# EasyEDA Pro project ProPrj_2024校电赛滤波器_2024-07-15.epro

# Schematic 滤波器+功放
Create Date: 2024-05-03; Page Name: P1; Project Name: 滤波器1.1; Schematic Name: Schematic1; Update Date: 2024-05-12; Company: 嘉立创EDA; Page Size: A4; Version: V1.0
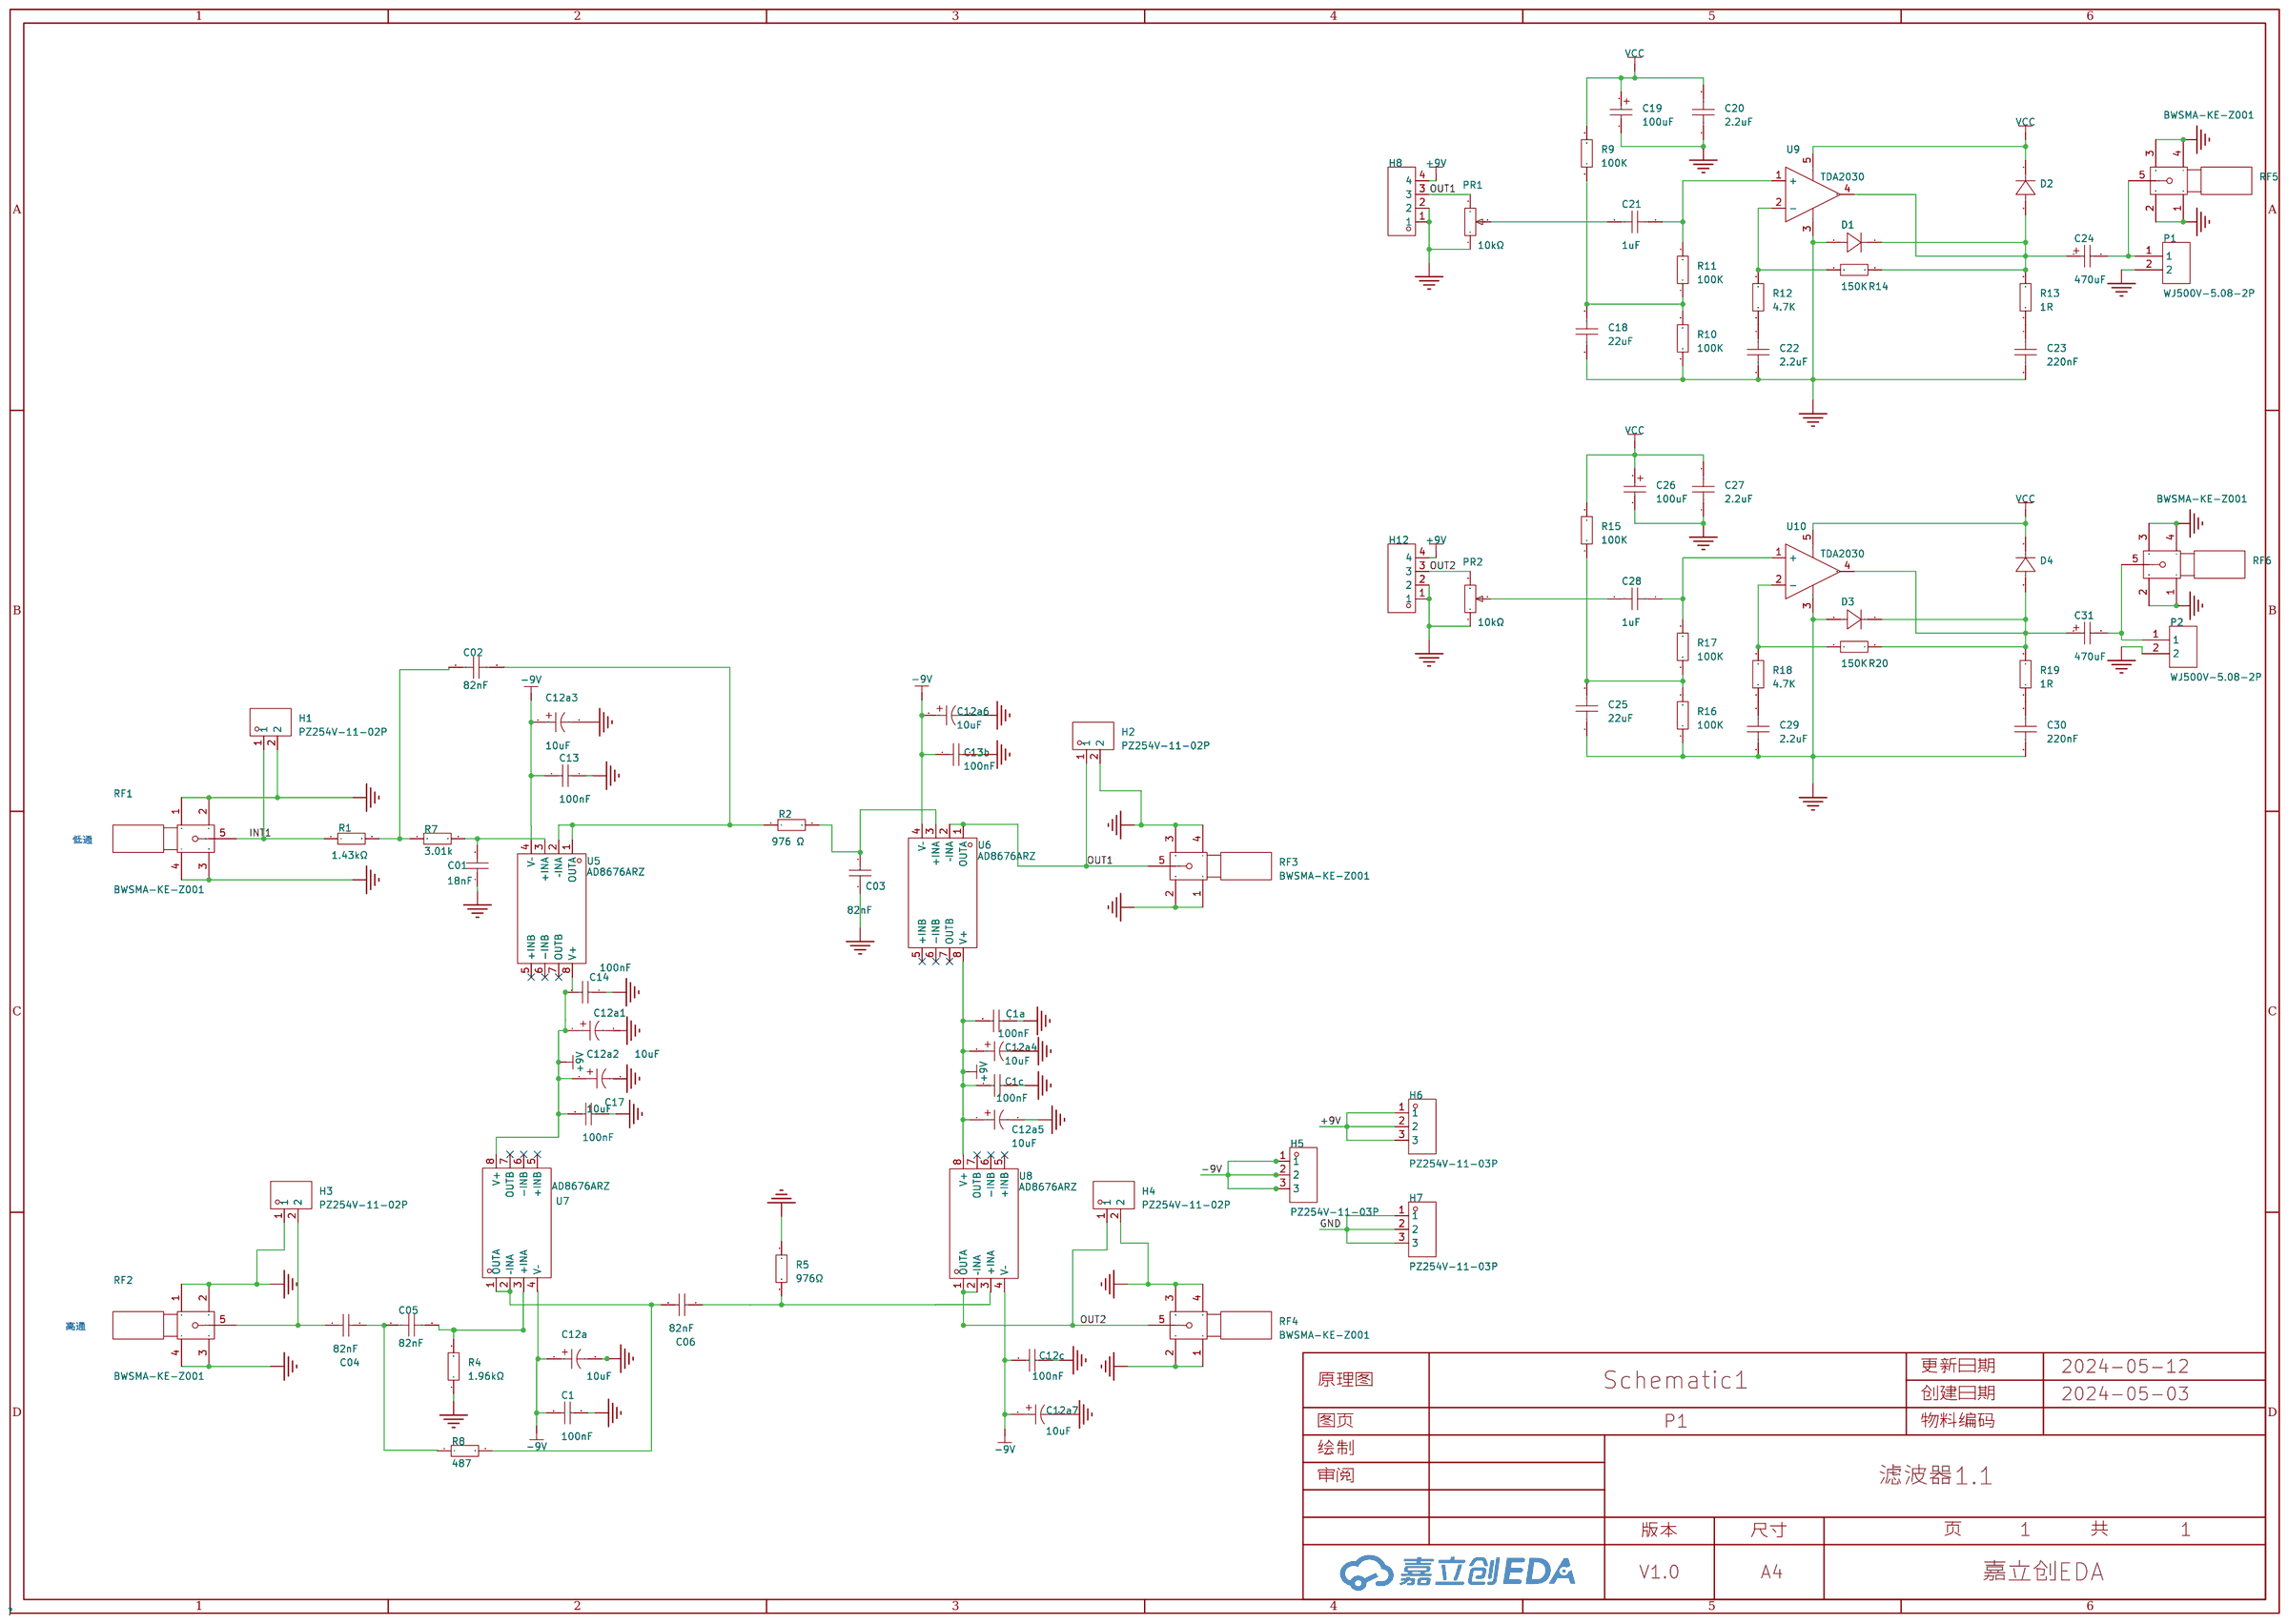
[diagram p0: schematic sheet]

## Parts
C01  18nF  [C0805]
C1  100nF  [C0805-100nF]
C1a  100nF  [C0805-100nF]
C1c  100nF  [C0805-100nF]
C02  82nF  [C0805]
C03  82nF  [C0805]
C04  82nF  [C0805]
C05  82nF  [C0805]
C06  82nF  [C0805]
C12a  10uF  [C-SMD5.4]
C12a1  10uF  [C-SMD5.4]
C12a2  10uF  [C-SMD5.4]
C12a3  10uF  [C-SMD5.4]
C12a4  10uF  [C-SMD5.4]
C12a5  10uF  [C-SMD5.4]
C12a6  10uF  [C-SMD5.4]
C12a7  10uF  [C-SMD5.4]
C12c  100nF  [C0805-100nF]
C13  100nF  [C0805-100nF]
C13b  100nF  [C0805-100nF]
C14  100nF  [C0805-100nF]
C17  100nF  [C0805-100nF]
C18  22uF  [C0805]
C19  100uF  [C_Ele_SMD_5x5.4mm]
C20  2.2uF  [C0805]
C21  1uF  [C0805]
C22  2.2uF  [C0805]
C23  220nF  [C0805]
C24  470uF  [C_Ele_SMD_5x5.4mm]
C25  22uF  [C0805]
C26  100uF  [C_Ele_SMD_5x5.4mm]
C27  2.2uF  [C0805]
C28  1uF  [C0805]
C29  2.2uF  [C0805]
C30  220nF  [C0805]
C31  470uF  [C_Ele_SMD_5x5.4mm]
D1  -  [DO_1N4007]
D2  -  [DO_1N4007]
D3  -  [DO_1N4007]
D4  -  [DO_1N4007]
H1  PZ254V-11-02P  [HDR-TH_2P-P2.54-V-M]
H2  PZ254V-11-02P  [HDR-TH_2P-P2.54-V-M]
H3  PZ254V-11-02P  [HDR-TH_2P-P2.54-V-M]
H4  PZ254V-11-02P  [HDR-TH_2P-P2.54-V-M]
H5  PZ254V-11-03P  [HDR-TH_3P-P2.54-V-M]
H6  PZ254V-11-03P  [HDR-TH_3P-P2.54-V-M]
H7  PZ254V-11-03P  [HDR-TH_3P-P2.54-V-M]
H8  -  [HDR-TH_4P-P2.54-V-M]
H12  -  [HDR-TH_4P-P2.54-V-M]
P1  WJ500V-5.08-2P  [CONN-TH_2P-P5.00_WJ500V-5.08-2P]
P2  WJ500V-5.08-2P  [CONN-TH_2P-P5.00_WJ500V-5.08-2P]
PR1  10kΩ  [R_3296]
PR2  10kΩ  [R_3296]
R1  1.43kΩ  [C0805]
R2  976 Ω  [C0805]
R4  1.96kΩ  [C0805]
R5  976Ω  [C0805]
R7  3.01k  [C0805]
R8  487  [C0805]
R9  100K  [R0805]
R10  100K  [R0805]
R11  100K  [R0805]
R12  4.7K  [R0805]
R13  1R  [R0805]
R14  150K  [R0805]
R15  100K  [R0805]
R16  100K  [R0805]
R17  100K  [R0805]
R18  4.7K  [R0805]
R19  1R  [R0805]
R20  150K  [R0805]
RF1  BWSMA-KE-Z001  [SMA-TH_BWSMA-KE-Z001]
RF2  BWSMA-KE-Z001  [SMA-TH_BWSMA-KE-Z001]
RF3  BWSMA-KE-Z001  [SMA-TH_BWSMA-KE-Z001]
RF4  BWSMA-KE-Z001  [SMA-TH_BWSMA-KE-Z001]
RF5  BWSMA-KE-Z001  [SMA-TH_BWSMA-KE-Z001]
RF6  BWSMA-KE-Z001  [SMA-TH_BWSMA-KE-Z001]
U5  AD8676ARZ  [SOIC-8_L4.9-W3.9-P1.27-LS6.0-BL]
U6  AD8676ARZ  [SOIC-8_L4.9-W3.9-P1.27-LS6.0-BL]
U7  AD8676ARZ  [SOIC-8_L4.9-W3.9-P1.27-LS6.0-BL]
U8  AD8676ARZ  [SOIC-8_L4.9-W3.9-P1.27-LS6.0-BL]
U9  TDA2030  [TO-220-5_L10.2-W4.8-P1.70-TL]
U10  TDA2030  [TO-220-5_L10.2-W4.8-P1.70-TL]

## Library data of the parts
C01 C1 C1a C1c C03 C04 C06 C12c C13 C13b C14 C17 = 0805B104J500NT: 容值:100nF;精度:±5%;额定电压:50V;材质(温度系数):X7R;; LCSC Part Name: 100nF ±5% 50V; Supplier Part: C29926; Manufacturer: FH(风华); Supplier Footprint: 0805; JLCPCB Part Class: 扩展库; Datasheet: https://atta.szlcsc.com/upload/public/pdf/source/20200305/C486355_26A10D38EF8C2A5C37091D0039909270.pdf; Supplier: LCSC; Tolerance: ±5%; Voltage Rated: 50V; Temperature Coefficient: X7R
C02 C05 = CAP_0603: Supplier Footprint: 0603
C12a C12a1-C12a7 = 293D106X9025C2WE3: 容值:220uF;精度:±20%;额定电压:16V;纹波电流:110mA@120Hz;等效串联电阻:-;; Supplier Part: C3009557; Manufacturer: VISHAY(威世); Supplier Footprint: 6032; JLCPCB Part Class: Extended Part; Datasheet: https://atta.szlcsc.com/upload/public/pdf/source/20230801/388CBBD5D388C822BCFA987A3F755494.pdf; Supplier: LCSC; Tolerance: ±20%; Rated Voltage: 16V; Ripple Current: 110mA@120Hz; φD: 6.3mm; L: 7.7mm; Lifetime @ Temp: 2000hrs@105℃; Operating Temperature: -55℃~+105℃
C18 C20-C23 C25 C27-C30 = CAP_0805: Supplier Footprint: 0805
C19 C24 C26 C31 = C_Ele_SMD_5x5.4mm: Supplier Footprint: SMD,5x5.4mm
D1-D4 = D_1N4007A: Supplier Footprint: DO-41
H1-H4 = PZ254V-11-02P: 插针结构:1x2P;间距:2.54mm;行距:-;圆针/方针:方针;安装类型:直插;排数:单排;总PIN位数:2P;额定电流:-;额定电压:-;配合针长度:6mm;塑高:2.5mm;端接针长度:3mm;触头材质:黄铜;触头镀层:-;工作温度范围:-40℃~+105℃;颜色:黑色;; LCSC Part Name: 间距:2.54mm 1x2P 直插 方针; Supplier Part: C492401; Manufacturer: XFCN(兴飞); Supplier Footprint: 插件,P=2.54mm; JLCPCB Part Class: 扩展库; Datasheet: https://atta.szlcsc.com/upload/public/pdf/source/20200309/C492401_A812433581A9B211A7FFA413ADDFF0E5.pdf; Supplier: LCSC; Pin Structure: 1x2P; Pitch: 2.54mm; Circluar Pins/Square Pins: 方针; Mounting Type: 直插; Number of Rows: 单排; Number of Pins: 2P; Length of Mating Pin: 6mm; Insulation Height: 2.5mm; Length of End Connection Pin: 3mm; Contact Material: 黄铜; Operating Temperature Range: -40℃~+105℃; Color: 黑色
H5-H7 = PZ254V-11-03P: 插针结构:1x3P;间距:2.54mm;行距:-;圆针/方针:方针;安装类型:直插;排数:单排;总PIN位数:3P;额定电流:3A;额定电压:250V;配合针长度:6mm;塑高:2.5mm;端接针长度:3mm;工作温度范围:-40℃~+105℃;颜色:黑色;; LCSC Part Name: 间距:2.54mm 1x3P 直插 方针; Supplier Part: C2937625; Manufacturer: XFCN(兴飞); Supplier Footprint: 插件,P=2.54mm; JLCPCB Part Class: 扩展库; Datasheet: https://atta.szlcsc.com/upload/public/pdf/source/20200309/C492402_8335C3D49C4E4C618838D59BB1D024C1.pdf; Supplier: LCSC; Pin Structure: 1x3P; Pitch: 2.54mm; Circluar Pins/Square Pins: 方针; Mounting Type: 直插; Number of Rows: 单排; Number of Pins: 3P; Current Rating (Max): 3A; Voltage Rating (Max): 250V; Length of Mating Pin: 6mm; Insulation Height: 2.5mm; Length of End Connection Pin: 3mm; Operating Temperature Range: -40℃~+105℃; Color: 黑色
H8 H12 = HDR-M_2.54_1x4P: Supplier Part: C492403; Supplier Footprint: 插件
P1 P2 = WJ500V-5.08-2P: 结构:1x2P;间距:5.08mm;颜色:绿色;安装方式:直插;额定电流:18A;额定电压:250V;排数:1;线规 - AWG:14~30;线规 - 平方毫米:2.5;每排PIN数:2;触头材质:-;触头镀层:-;工作温度范围:-40℃~+105℃;焊接温度(最大值):-;; LCSC Part Name: 1x2P 5.08mm 直插 排数:1 每排P数:2; Supplier Part: C8465; Manufacturer: KANGNEX(康奈克斯电气); Supplier Footprint: 插件,P=5.08mm; JLCPCB Part Class: Extended Part; Datasheet: https://atta.szlcsc.com/upload/public/pdf/source/20191225/C8465_02D34CE5B5B4A53DF5891601D97FA9F4.pdf; Supplier: LCSC; Structure: 1x2P; Pitch: 5.08mm; Color: 绿色; Mounting Style: 直插; Current Rating (Max): 18A; Voltage Rating (Max): 250V; Number of Pins: 2P; Number of Rows: 1; Wire Gauge - AWG: 14~30; Wire Gauge - mm2: 2.5; Number of PINs Per Row: 2; Operating Temperature Range: -40℃~+105℃; Screw Specification: M2.5
PR1 PR2 = R_3296: Supplier Footprint: 直插
R1 R2 R4 R5 = 0805W8F1002T5E_C17414: 电阻类型:厚膜电阻;阻值:10kΩ;精度:±1%;功率:125mW;最大工作电压:150V;温度系数:±100ppm/℃;; LCSC Part Name: 10kΩ ±1% 125mW 厚膜电阻; Supplier Part: C17414; Manufacturer: UNI-ROYAL(厚声); Manufacturer Part: 0805W8F1002T5E; Supplier Footprint: 0805; JLCPCB Part Class: 基础库; Datasheet: https://atta.szlcsc.com/upload/public/pdf/source/20200306/C422600_1E6D84923E4A46A82E41ADD87F860B5C.pdf; Supplier: LCSC; Type: 厚膜电阻; Tolerance: ±1%; Power(Watts): 125mW; Overload Voltage (Max): 150V; Temperature Coefficient: ±100ppm/℃; Operating Temperature Range: -55℃~+155℃
R7 R8 = Res_0603: Supplier Footprint: 0603
R9-R20 = Res_0805: Supplier Footprint: 0805
RF1-RF6 = BWSMA-KE-Z001_C496549: 连接器类型:板端;接口类型:内孔;端口数量:1;接口直径:-;接口长度/高度:-;频率-最大值:-;射频系列:SMA;阻抗:50Ω;样式:正脚;触头材质:-;触头镀层:-;工作温度范围:-65℃~+165℃;焊接温度(最大值):-;; LCSC Part Name: 内孔 SMA 正脚; Supplier Part: C496549; Manufacturer: BAT WIRELESS(蝙蝠无线); Supplier Footprint: 插件; JLCPCB Part Class: 扩展库; Datasheet: https://atta.szlcsc.com/upload/public/pdf/source/20221228/40BF41E56A06003A0210E1785CA66EA6.pdf; Supplier: LCSC; Connector Type: 板端; Interface Type: 内孔; Number of Ports: 1; RF Series: SMA; Impedance: 50Ω; Style: 正脚; Operating Temperature Range: -65℃~+165℃
U5-U8 = AD8676ARZ: 放大器数:双路;增益带宽积(GBP):10MHz;输入偏置电流(Ib):2nA;压摆率(SR):2.5V/us;带宽(-3db):-;轨到轨:-;; Supplier Part: C99967; Manufacturer: ADI(亚德诺); Supplier Footprint: SOIC-8; JLCPCB Part Class: 扩展库; Datasheet: https://atta.szlcsc.com/upload/public/pdf/source/20170330/1490855744326.pdf; Supplier: LCSC; Number of Circuits: 双路; Gain Bandwidth Product(GBP): 10MHz; Current - Input Bias(Ib): 2nA; Slew Rate(SR): 2.5V/us; Output Current: 20mA; Supply Current: 2.7mA; Operating Temperature: -40℃~+125℃
U9 U10 = TDA2030_C5296731: TDA2030AL-TB5-T TDA2030 TDA2030L-TB5-T TFA2050; LCSC Part Name: TDA2030A; Supplier Part: C5296731; Manufacturer: JSMSEMI(杰盛微); Supplier Footprint: FZIP5; JLCPCB Part Class: 扩展库; Datasheet: https://atta.szlcsc.com/upload/public/pdf/source/20240105/2117F205BDD887DF1502453718A0C1E3.pdf; Supplier: LCSC

## Nets
+9V: C1a.2 C1c.2 C12a1.1 C12a2.1 C12a4.1 C12a5.1 C14.2 C17.2 H6.1 H6.2 H6.3 H8.4 H12.4 U5.8(V+) U7.8(V+)
-9V: C1.2 C12a.1 C12a3.1 C12a6.1 C12a7.1 C12c.2 C13.2 C13b.2 H5.1 H5.2 H5.3 U5.4(V–) U7.4(V–)
GND: C01.1 C1.1 C1a.1 C1c.1 C03.1 C12a.2 C12a1.2 C12a2.2 C12a3.2 C12a4.2 C12a5.2 C12a6.2 C12a7.2 C12c.1 C13.1 C13b.1 C14.1 C17.1 C18.1 C19.2 C20.1 C22.2 C23.2 C25.1 C26.2 C27.1 C29.2 C30.2 D1.2(A) D3.2(A) H1.2 H2.2 H3.1 H4.2 H7.1 H7.2 H7.3 H8.1 H8.2 H12.1 H12.2 P1.2 P2.2 PR1.1 PR2.1 R4.1 R5.1 R10.1 R16.1 RF1.1 RF1.2 RF1.3 RF1.4 RF2.1 RF2.2 RF2.3 RF2.4 RF3.1 RF3.2 RF3.3 RF3.4 RF4.1 RF4.2 RF4.3 RF4.4 RF5.1 RF5.2 RF5.3 RF5.4 RF6.1 RF6.2 RF6.3 RF6.4 U9.3(GND) U10.3(GND)
VCC: C19.1 C20.2 C26.1 C27.2 D2.1(K) D4.1(K) R9.2 R15.2 U9.5(VCC+) U10.5(VCC+)
INT1: H1.1 R1.1 RF1.5
OUT1: H2.1 H8.3 PR1.3 RF3.5 U6.1(OUTA) U6.2(–INA)
OUT2: H4.1 H12.3 PR2.3 RF4.5 U8.1(OUTA) U8.2(–INA)
$1N5778: C04.1 C05.1 R8.1
$1N9967: C05.2 R4.2 U7.3(+INA)
$1N9995: C06.2 R8.2 U7.1(OUTA) U7.2(–INA)
$1N10092: C06.1 R5.2 U8.3(+INA)
$1N24552: C21.2 PR1.2
$1N24662: C18.2 R9.1 R10.2 R11.1
$1N24719: C22.1 R12.1
$1N29433: C21.1 R11.2 U9.1(+)
$1N29500: C23.1 R13.1
$1N29639: R12.2 R14.1 U9.2(-)
$1N29806: C24.1 D1.1(K) D2.2(A) R13.2 R14.2 U9.4(OUT)
$1N30495: C28.2 PR2.2
$1N30496: C25.2 R15.1 R16.2 R17.1
$1N30497: C29.1 R18.1
$1N30500: C28.1 R17.2 U10.1(+)
$1N30515: C30.1 R19.1
$1N30517: R18.2 R20.1 U10.2(-)
$1N30526: C31.1 D3.1(K) D4.2(A) R19.2 R20.2 U10.4(OUT)
Net-(C01-2): C01.2 R7.2 U5.3(+INA)
Net-(C02-1): C02.1 R1.2 R7.1
Net-(C03-2): C03.2 R2.2 U6.3(+INA)
Net-(C04-2): C04.2 H3.2 RF2.5
Net-(C24-2): C24.2 P1.1 RF5.5
Net-(C31-2): C31.2 P2.1 RF6.5
Net-(R2-1): R2.1 U5.1(OUTA) U5.2(–INA)

Not connected (* = marked no-connect by the designer): C02 2; U5 5(+INB)* 6(-INB)* 7(OUTB)*; U6 4(V–) 5(+INB)* 6(-INB)* 7(OUTB)* 8(V+); U7 5(+INB)* 6(-INB)* 7(OUTB)*; U8 4(V–) 5(+INB)* 6(-INB)* 7(OUTB)* 8(V+)

## Notes on the sheet
- 低通
- 高通

# Schematic 滤波器
Create Date: 2024-05-02; Page Name: P1; Project Name: 2024电赛滤波器; Schematic Name: Schematic1; Update Date: 2024-05-03; Company: 嘉立创EDA; Page Size: A4; Version: V1.0
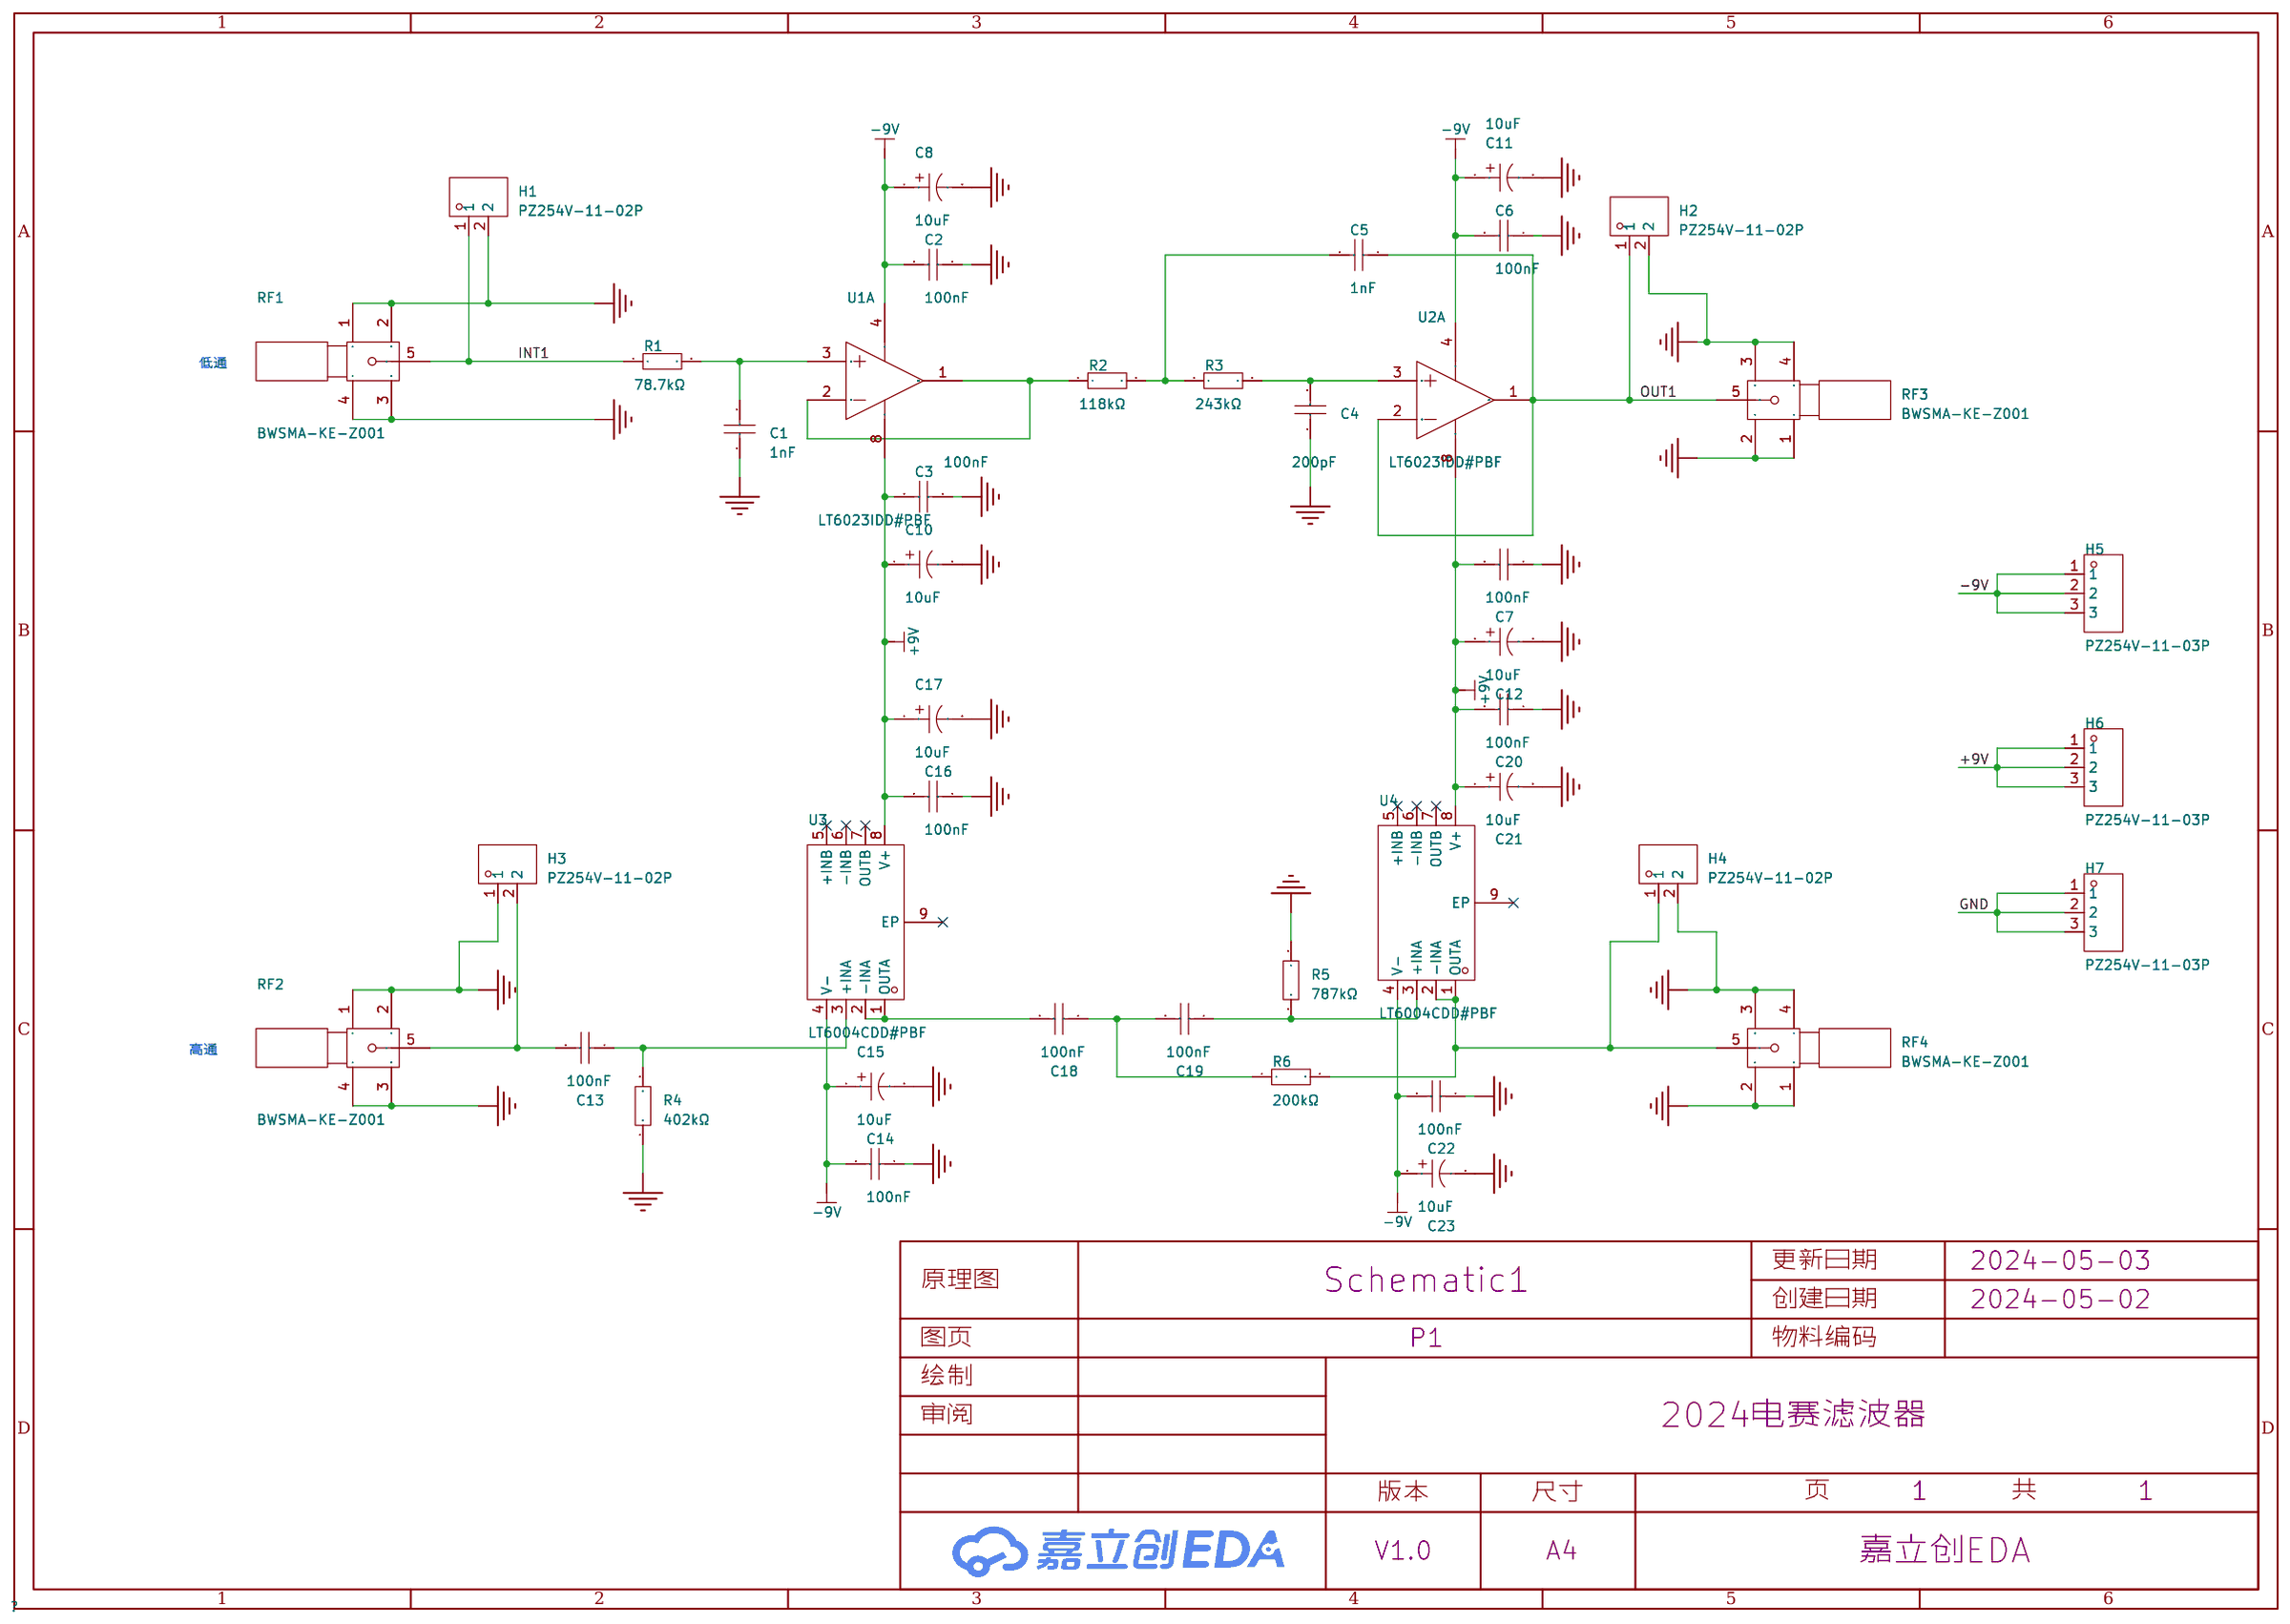
[diagram p1: schematic sheet]

## Parts
C1  1nF  [C0805]
C2  100nF  [C0805]
C3  100nF  [C0805]
C4  200pF  [C0805]
C5  1nF  [C0805]
C6  100nF  [C0805]
C7  100nF  [C0805]
C8  10uF  [CAP-SMD_BD6.3-L6.6-W6.6-FD]
C10  10uF  [CAP-SMD_BD6.3-L6.6-W6.6-FD]
C11  10uF  [CAP-SMD_BD6.3-L6.6-W6.6-FD]
C12  10uF  [CAP-SMD_BD6.3-L6.6-W6.6-FD]
C13  100nF  [C0805]
C14  100nF  [C0805]
C15  10uF  [CAP-SMD_BD6.3-L6.6-W6.6-FD]
C16  100nF  [C0805]
C17  10uF  [CAP-SMD_BD6.3-L6.6-W6.6-FD]
C18  100nF  [C0805]
C19  100nF  [C0805]
C20  100nF  [C0805]
C21  10uF  [CAP-SMD_BD6.3-L6.6-W6.6-FD]
C22  100nF  [C0805]
C23  10uF  [CAP-SMD_BD6.3-L6.6-W6.6-FD]
H1  PZ254V-11-02P  [HDR-TH_2P-P2.54-V-M]
H2  PZ254V-11-02P  [HDR-TH_2P-P2.54-V-M]
H3  PZ254V-11-02P  [HDR-TH_2P-P2.54-V-M]
H4  PZ254V-11-02P  [HDR-TH_2P-P2.54-V-M]
H5  PZ254V-11-03P  [HDR-TH_3P-P2.54-V-M]
H6  PZ254V-11-03P  [HDR-TH_3P-P2.54-V-M]
H7  PZ254V-11-03P  [HDR-TH_3P-P2.54-V-M]
R1  78.7kΩ  [R0805]
R2  118kΩ  [R0805]
R3  243kΩ  [R0805]
R4  402kΩ  [R0805]
R5  787kΩ  [R0805]
R6  200kΩ  [R0805]
RF1  BWSMA-KE-Z001  [SMA-TH_BWSMA-KE-Z001]
RF2  BWSMA-KE-Z001  [SMA-TH_BWSMA-KE-Z001]
RF3  BWSMA-KE-Z001  [SMA-TH_BWSMA-KE-Z001]
RF4  BWSMA-KE-Z001  [SMA-TH_BWSMA-KE-Z001]
U1  LT6023IDD#PBF  [DFN-8_L3.0-W3.0-P0.50-BL-EP-1]  (section 1)
U2  LT6023IDD#PBF  [DFN-8_L3.0-W3.0-P0.50-BL-EP-1]  (section 1)
U3  LT6004CDD#PBF  [DFN-8_L3.0-W3.0-P0.50-BL-EP]
U4  LT6004CDD#PBF  [DFN-8_L3.0-W3.0-P0.50-BL-EP]

## Library data of the parts
C1-C7 C13 C14 C16 C18-C20 C22 = 0805B104J500NT: 容值:100nF;精度:±5%;额定电压:50V;材质(温度系数):X7R;; LCSC Part Name: 100nF ±5% 50V; Supplier Part: C29926; Manufacturer: FH(风华); Supplier Footprint: 0805; JLCPCB Part Class: 扩展库; Datasheet: https://atta.szlcsc.com/upload/public/pdf/source/20200305/C486355_26A10D38EF8C2A5C37091D0039909270.pdf; Supplier: LCSC; Tolerance: ±5%; Voltage Rated: 50V; Temperature Coefficient: X7R
C8 C10-C12 C15 C17 C21 C23 = RVT220UF16V67RV0015: 容值:220uF;精度:±20%;额定电压:16V;纹波电流:110mA@120Hz;等效串联电阻:-;; LCSC Part Name: 220uF ±20% 16V; Supplier Part: C2887273; Manufacturer: KNSCHA(科尼盛); Supplier Footprint: SMD,D6.3xL7.7mm; JLCPCB Part Class: 扩展库; Datasheet: https://atta.szlcsc.com/upload/public/pdf/source/20210824/3DC9999D9B098FE241E3A26137981C4C.pdf; Supplier: LCSC; Tolerance: ±20%; Rated Voltage: 16V; Ripple Current: 110mA@120Hz; φD: 6.3mm; L: 7.7mm; Lifetime @ Temp: 2000hrs@105℃; Operating Temperature: -55℃~+105℃
H1-H4 = PZ254V-11-02P: 插针结构:1x2P;间距:2.54mm;行距:-;圆针/方针:方针;安装类型:直插;排数:单排;总PIN位数:2P;额定电流:-;额定电压:-;配合针长度:6mm;塑高:2.5mm;端接针长度:3mm;触头材质:黄铜;触头镀层:-;工作温度范围:-40℃~+105℃;颜色:黑色;; LCSC Part Name: 间距:2.54mm 1x2P 直插 方针; Supplier Part: C492401; Manufacturer: XFCN(兴飞); Supplier Footprint: 插件,P=2.54mm; JLCPCB Part Class: 扩展库; Datasheet: https://atta.szlcsc.com/upload/public/pdf/source/20200309/C492401_A812433581A9B211A7FFA413ADDFF0E5.pdf; Supplier: LCSC; Pin Structure: 1x2P; Pitch: 2.54mm; Circluar Pins/Square Pins: 方针; Mounting Type: 直插; Number of Rows: 单排; Number of Pins: 2P; Length of Mating Pin: 6mm; Insulation Height: 2.5mm; Length of End Connection Pin: 3mm; Contact Material: 黄铜; Operating Temperature Range: -40℃~+105℃; Color: 黑色
H5-H7 = PZ254V-11-03P: 插针结构:1x3P;间距:2.54mm;行距:-;圆针/方针:方针;安装类型:直插;排数:单排;总PIN位数:3P;额定电流:3A;额定电压:250V;配合针长度:6mm;塑高:2.5mm;端接针长度:3mm;工作温度范围:-40℃~+105℃;颜色:黑色;; LCSC Part Name: 间距:2.54mm 1x3P 直插 方针; Supplier Part: C2937625; Manufacturer: XFCN(兴飞); Supplier Footprint: 插件,P=2.54mm; JLCPCB Part Class: 扩展库; Datasheet: https://atta.szlcsc.com/upload/public/pdf/source/20200309/C492402_8335C3D49C4E4C618838D59BB1D024C1.pdf; Supplier: LCSC; Pin Structure: 1x3P; Pitch: 2.54mm; Circluar Pins/Square Pins: 方针; Mounting Type: 直插; Number of Rows: 单排; Number of Pins: 3P; Current Rating (Max): 3A; Voltage Rating (Max): 250V; Length of Mating Pin: 6mm; Insulation Height: 2.5mm; Length of End Connection Pin: 3mm; Operating Temperature Range: -40℃~+105℃; Color: 黑色
R1-R6 = 0805W8F1002T5E_C17414: 电阻类型:厚膜电阻;阻值:10kΩ;精度:±1%;功率:125mW;最大工作电压:150V;温度系数:±100ppm/℃;; LCSC Part Name: 10kΩ ±1% 125mW 厚膜电阻; Supplier Part: C17414; Manufacturer: UNI-ROYAL(厚声); Manufacturer Part: 0805W8F1002T5E; Supplier Footprint: 0805; JLCPCB Part Class: 基础库; Datasheet: https://atta.szlcsc.com/upload/public/pdf/source/20200306/C422600_1E6D84923E4A46A82E41ADD87F860B5C.pdf; Supplier: LCSC; Type: 厚膜电阻; Tolerance: ±1%; Power(Watts): 125mW; Overload Voltage (Max): 150V; Temperature Coefficient: ±100ppm/℃; Operating Temperature Range: -55℃~+155℃
RF1-RF4 = BWSMA-KE-Z001_C496549: 连接器类型:板端;接口类型:内孔;端口数量:1;接口直径:-;接口长度/高度:-;频率-最大值:-;射频系列:SMA;阻抗:50Ω;样式:正脚;触头材质:-;触头镀层:-;工作温度范围:-65℃~+165℃;焊接温度(最大值):-;; LCSC Part Name: 内孔 SMA 正脚; Supplier Part: C496549; Manufacturer: BAT WIRELESS(蝙蝠无线); Supplier Footprint: 插件; JLCPCB Part Class: 扩展库; Datasheet: https://atta.szlcsc.com/upload/public/pdf/source/20221228/40BF41E56A06003A0210E1785CA66EA6.pdf; Supplier: LCSC; Connector Type: 板端; Interface Type: 内孔; Number of Ports: 1; RF Series: SMA; Impedance: 50Ω; Style: 正脚; Operating Temperature Range: -65℃~+165℃
U1 U2 = LT6023IDD#PBF: 放大器数:双路;增益带宽积(GBP):40kHz;输入偏置电流(Ib):100pA;压摆率(SR):1V/us;轨到轨:-;; Supplier Part: C672817; Manufacturer: ADI(亚德诺); Supplier Footprint: DFN-8-EP(3x3); JLCPCB Part Class: 扩展库; Datasheet: https://atta.szlcsc.com/upload/public/pdf/source/20220519/CD073A2F300BDFEBFC1474DA916FA7C3.pdf; Supplier: LCSC; Number of Circuits: 双路; Gain Bandwidth Product(GBP): 40kHz; Current - Input Bias(Ib): 100pA; Slew Rate(SR): 1V/us; Output Current: 15mA; Operating Temperature: -40℃~+85℃
U3 U4 = LT6004CDD#PBF: 放大器数:双路;增益带宽积(GBP):3kHz;输入偏置电流(Ib):7pA;压摆率(SR):0.55V/us;轨到轨:-;; Supplier Part: C672674; Manufacturer: ADI(亚德诺); Supplier Footprint: DFN-8-EP(3x3); JLCPCB Part Class: 扩展库; Datasheet: https://atta.szlcsc.com/upload/public/pdf/source/20170712/C117424_1499832425421814607.pdf; Supplier: LCSC; Number of Circuits: 双路; Gain Bandwidth Product(GBP): 3kHz; Current - Input Bias(Ib): 7pA; Slew Rate(SR): 0.55V/us; Output Current: 9mA; Operating Temperature: 0℃~+85℃

## Nets
+9V: C3.2 C7.2 C10.1 C12.1 C16.2 C17.1 C20.2 C21.1 H6.1 H6.2 H6.3 U1.8(V+) U2.8(V+) U3.8(V+) U4.8(V+)
-9V: C2.2 C6.2 C8.1 C11.1 C14.2 C15.1 C22.2 C23.1 H5.1 H5.2 H5.3 U1.4(V-) U2.4(V-) U3.4(V-) U4.4(V-)
GND: C1.1 C2.1 C3.1 C4.1 C6.1 C7.1 C8.2 C10.2 C11.2 C12.2 C14.1 C15.2 C16.1 C17.2 C20.1 C21.2 C22.1 C23.2 H1.2 H2.2 H3.1 H4.2 H7.1 H7.2 H7.3 R4.1 R5.1 RF1.1 RF1.2 RF1.3 RF1.4 RF2.1 RF2.2 RF2.3 RF2.4 RF3.1 RF3.2 RF3.3 RF3.4 RF4.1 RF4.2 RF4.3 RF4.4
INT1: H1.1 R1.1 RF1.5
OUT1: C5.1 H2.1 RF3.5 U2.1(OUT A) U2.2(-IN A)
$1N252: C1.2 R1.2 U1.3(+IN A)
$1N745: R2.1 U1.1(OUT A) U1.2(-IN A)
$1N884: C4.2 R3.2 U2.3(+IN A)
$1N953: C5.2 R2.2 R3.1
$1N2206: C13.1 R4.2 U3.3(+INA)
$1N2548: C18.2 U3.1(OUTA) U3.2(-INA)
$1N2589: C19.1 R5.2 U4.3(+INA)
$1N3642: C18.1 C19.2 R6.1
Net-(C13-2): C13.2 H3.2 RF2.5
Net-(H4-1): H4.1 R6.2 RF4.5 U4.1(OUTA) U4.2(-INA)

Not connected (* = marked no-connect by the designer): U3 5(+INB)* 6(-INB)* 7(OUTB)* 9(EP)*; U4 5(+INB)* 6(-INB)* 7(OUTB)* 9(EP)*

## Notes on the sheet
- 低通
- 高通

# Board 滤波器+功放
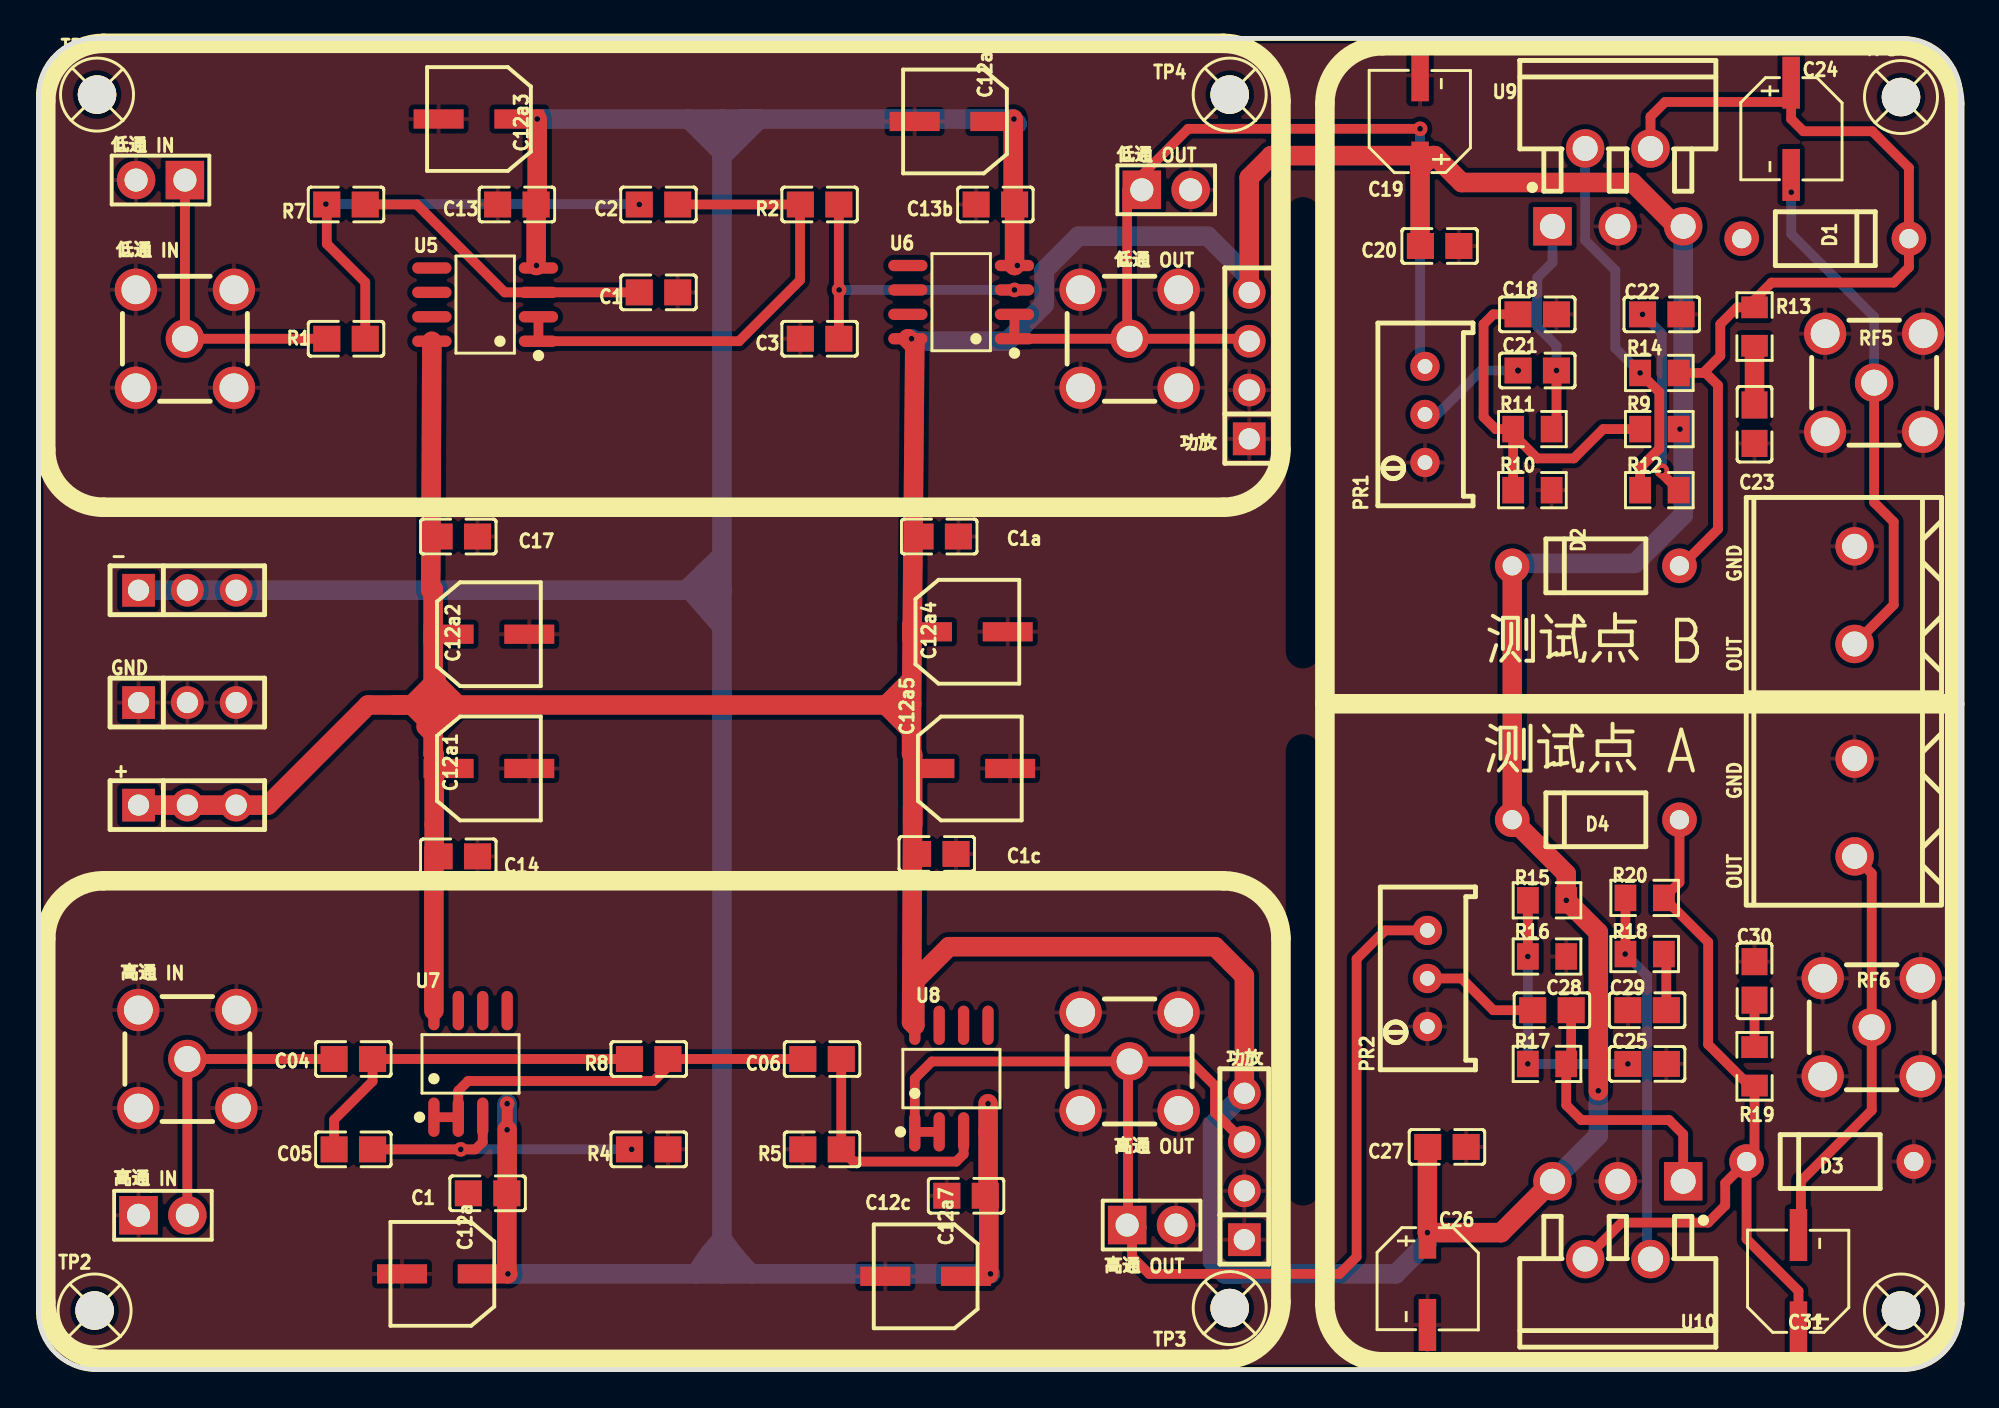
[diagram p2: board, top side]
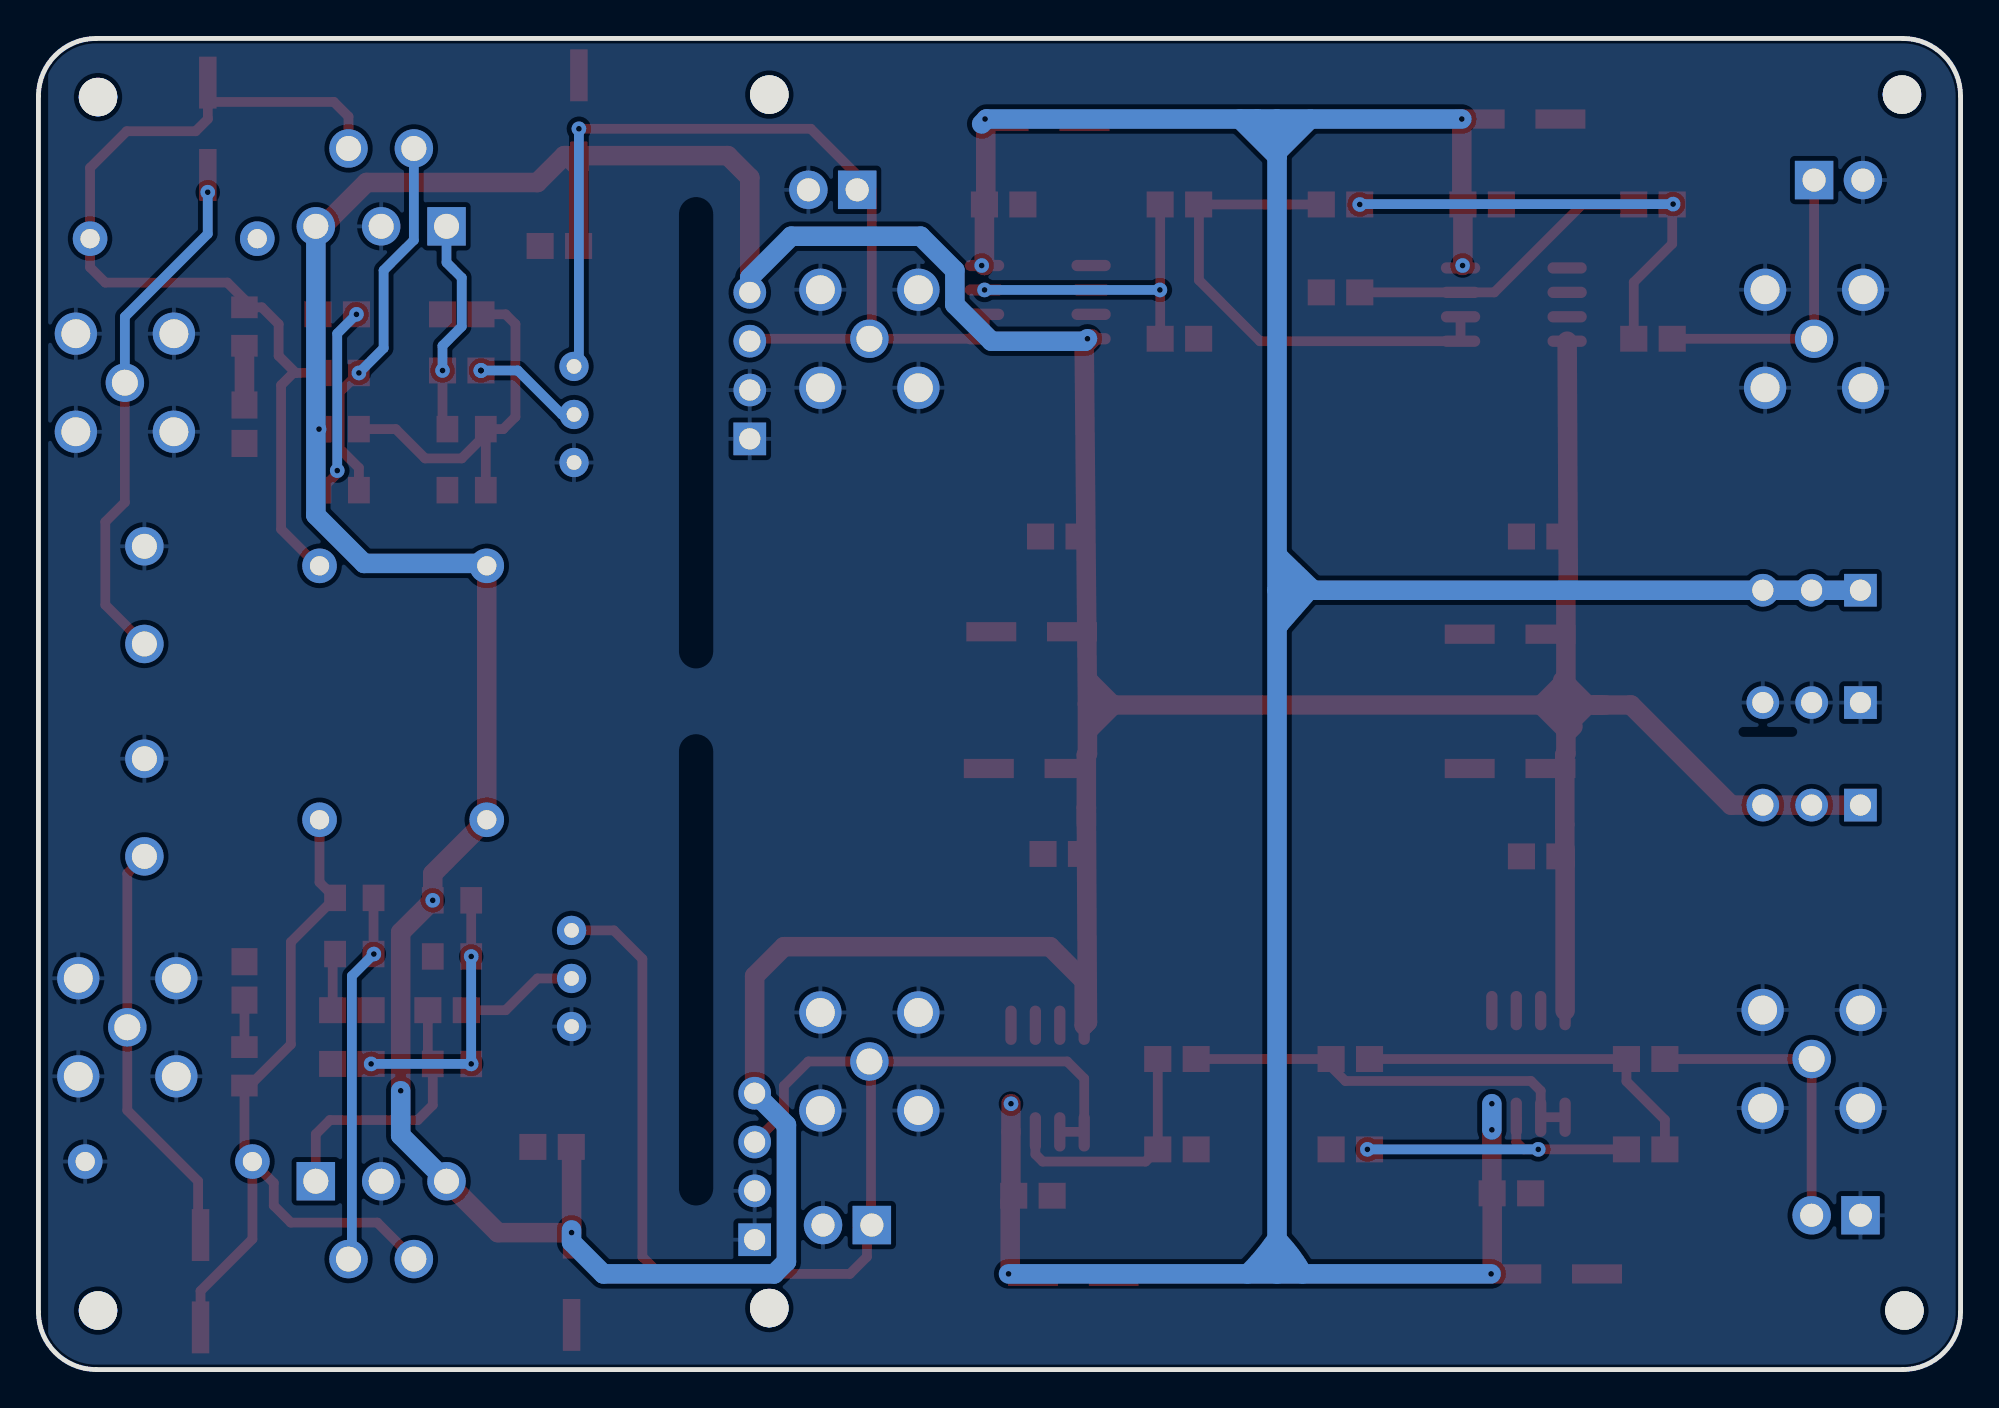
[diagram p3: board, bottom side, seen from below]

Outline 100 x 69.24 mm; copper layers: Top Layer, Bottom Layer. Coordinates in mm from the lower left corner of the outline.
Outline path: 0,66.24 0,3 arc(0.88,0.88) 3,0 97,0 arc(99.12,0.88) 100,3 100,66.24 arc(99.12,68.36) 97,69.24 3,69.24 arc(0.88,68.36) 0,66.24
Stack: Top Layer 0.035mm - / Dielectric1 1.51mm FR4 er 4.5 / Bottom Layer 0.035mm -

## Design rules (mm)
template: 自定义配置
spacing copperThickness1oz (default): track to track 0.102, other pairs 0.152 to 0.3
spacing copperThickness2oz: track to track 0.203, other pairs 0.152 to 0.3
track width copperThickness1oz (default): min 0.127, default 0.254, max 2.54
track width copperThickness2oz: min 0.203, default 0.254, max 2.54
differential pair differentialPair (default): width min 0.127, default 0.254, max 2.54; gap min 0.152, default 0.152
via viaSize (default): diameter min 0.5, default 0.61, max 10; hole min 0.3, default 0.305, max 6.3
net -9V uses copperThickness2oz
net +9V uses copperThickness2oz

## Placement (name value [footprint] x y rotation side)
+  PZ254V-11-03P  [HDR-TH_3P-P2.54-V-M]  7.75 29.36 0 top
-  PZ254V-11-03P  [HDR-TH_3P-P2.54-V-M]  7.75 40.54 0 top
C1  100nF  [C0805]  32.26 56.03 180 top
C1#2  -  [C0805-100nF]  23.37 9.17 0 top
C1a  100nF  [C0805-100nF]  46.86 43.33 180 top
C1c  100nF  [C0805-100nF]  46.74 26.82 180 top
C2  82nF  [C0805]  32.26 60.6 0 top
C3  82nF  [C0805]  40.64 53.62 0 top
C04  82nF  [C0805]  16.38 16.15 180 top
C05  82nF  [C0805]  16.38 11.45 0 top
C06  82nF  [C0805]  40.77 16.15 180 top
C12a  10uF  [C-SMD5.4]  23.11 4.98 270 top
C12a1  10uF  [C-SMD5.4]  21.34 31.26 90 top
C12a2  10uF  [C-SMD5.4]  21.34 38.25 90 top
C12a3  10uF  [C-SMD5.4]  25.02 65.05 270 top
C12a4  10uF  [C-SMD5.4]  46.23 38.38 90 top
C12a5  10uF  [C-SMD5.4]  46.36 31.26 90 top
C12a6  10uF  [C-SMD5.4]  49.78 64.92 270 top
C12a7  10uF  [C-SMD5.4]  48.26 4.85 270 top
C12c  100nF  [C0805-100nF]  48.26 9.04 0 top
C13  100nF  [C0805-100nF]  24.89 60.6 0 top
C13b  100nF  [C0805-100nF]  49.78 60.6 0 top
C14  100nF  [C0805-100nF]  21.84 26.69 180 top
C17  100nF  [C0805-100nF]  21.84 43.33 180 top
C18  22uF  [C0805]  77.98 54.89 180 top
C19  100uF  [C_Ele_SMD_5x5.4mm]  71.88 64.92 90 top
C20  2.2uF  [C0805]  72.9 58.44 180 top
C21  1uF  [C0805]  77.98 51.97 180 top
C22  2.2uF  [C0805]  84.45 54.89 0 top
C23  220nF  [C0805]  89.28 49.17 270 top
C24  470uF  [C_Ele_SMD_5x5.4mm]  91.19 64.54 270 top
C25  22uF  [C0805]  83.69 15.9 180 top
C26  100uF  [C_Ele_SMD_5x5.4mm]  72.26 4.72 270 top
C27  2.2uF  [C0805]  73.28 11.58 180 top
C28  1uF  [C0805]  78.74 18.69 180 top
C29  2.2uF  [C0805]  83.69 18.69 180 top
C30  220nF  [C0805]  89.28 20.22 90 top
C31  470uF  [C_Ele_SMD_5x5.4mm]  91.57 4.59 90 top
D1  1N4001  [DO_1N4007]  92.96 58.82 180 top
D2  1N4001  [DO_1N4007]  81.03 41.81 0 top
D3  -  [DO_1N4007]  93.22 10.82 0 top
D4  -  [DO_1N4007]  81.03 28.6 0 top
GND  PZ254V-11-03P  [HDR-TH_3P-P2.54-V-M]  7.75 34.69 0 top
OUT      GND  -  [CONN-TH_2P-P5.00_WJ500V-5.08-2P]  94.49 29.23 90 top
OUT      GND#2  -  [CONN-TH_2P-P5.00_WJ500V-5.08-2P]  94.49 40.28 90 top
PR1  10kΩ  [R_3296]  72.01 49.68 90 top
PR2  10kΩ  [R_3296]  72.14 20.34 90 top
R1  1.43kΩ  [C0805]  16 53.62 0 top
R2  976 Ω  [C0805]  40.64 60.6 0 top
R4  1.96kΩ  [C0805]  31.75 11.45 180 top
R5  976Ω  [C0805]  40.77 11.45 0 top
R7  3.01k  [C0805]  16 60.6 0 top
R8  487  [C0805]  31.75 16.15 0 top
R9  100K  [R0805]  84.33 48.92 0 top
R10  100K  [R0805]  77.72 45.74 180 top
R11  100K  [R0805]  77.72 48.92 0 top
R12  4.7K  [R0805]  84.33 45.74 180 top
R13  1R  [R0805]  89.28 54.25 90 top
R14  150K  [R0805]  84.33 51.84 0 top
R15  100K  [R0805]  78.49 24.41 0 top
R16  100K  [R0805]  78.49 21.49 180 top
R17  100K  [R0805]  78.49 15.9 0 top
R18  4.7K  [R0805]  83.57 21.61 180 top
R19  1R  [R0805]  89.28 15.77 270 top
R20  150K  [R0805]  83.57 24.53 0 top
RF5  BWSMA-KE-Z001  [SMA-TH_BWSMA-KE-Z001]  95.5 51.33 0 top
RF6  BWSMA-KE-Z001  [SMA-TH_BWSMA-KE-Z001]  95.38 17.8 0 top
TP1  -  [M2螺丝]  3.05 66.32 0 top
TP2  -  [M2螺丝]  2.92 3.07 0 top
TP3  -  [M2螺丝]  61.98 3.2 0 top
TP4  -  [M2螺丝]  61.98 66.32 0 top
TP5  -  [M2螺丝]  96.9 66.19 0 top
TP6  -  [M2螺丝]  96.9 3.07 0 top
U5  AD8676ARZ  [SOIC-8_L4.9-W3.9-P1.27-LS6.0-BL]  23.24 55.39 90 top
U6  AD8676ARZ  [SOIC-8_L4.9-W3.9-P1.27-LS6.0-BL]  48.01 55.52 90 top
U7  AD8676ARZ  [SOIC-8_L4.9-W3.9-P1.27-LS6.0-BL]  22.48 15.9 0 top
U8  AD8676ARZ  [SOIC-8_L4.9-W3.9-P1.27-LS6.0-BL]  47.5 15.14 0 top
U9  TDA2030  [TO-220-5_L10.2-W4.8-P1.70-TL]  82.17 61.49 90 top
U10  TDA2030  [TO-220-5_L10.2-W4.8-P1.70-TL]  82.17 7.77 270 top
低通 IN  -  [HDR-TH_2P-P2.54-V-M]  6.35 61.87 180 top
低通 IN#2  -  [SMA-TH_BWSMA-KE-Z001]  7.62 53.62 0 top
低通 OUT  -  [HDR-TH_2P-P2.54-V-M]  58.67 61.36 0 top
低通 OUT#2  -  [SMA-TH_BWSMA-KE-Z001]  56.77 53.62 0 top
功放  -  [HDR-TH_4P-P2.54-V-M]  62.99 52.22 90 top
功放#2  -  [HDR-TH_4P-P2.54-V-M]  62.74 10.56 90 top
高通 IN  -  [HDR-TH_2P-P2.54-V-M]  6.48 8.02 0 top
高通 IN#2  -  [SMA-TH_BWSMA-KE-Z001]  7.75 16.15 0 top
高通 OUT  -  [HDR-TH_2P-P2.54-V-M]  57.91 7.52 0 top
高通 OUT#2  -  [SMA-TH_BWSMA-KE-Z001]  56.77 16.02 0 top

## Footprints (pads in the part's own frame, mm; a bottom-side part is the same pattern mirrored in y, then rotated)
C0805
  rect 1.41x1.35 smd: 1(-1,0) 2(1,0)
C0805-100nF
  rect 1.41x1.35 smd: 1(-1,0) 2(1,0)
C-SMD5.4
  rect 1x2.6 smd: 1(0,0) 2(0,-4.2)
C_Ele_SMD_5x5.4mm
  rect 2.7x0.91 smd: 1(-2.4,0) 2(2.4,0)
CONN-TH_2P-P5.00_WJ500V-5.08-2P
  round 2 hole 1.3: 1(-2.54,0) 2(2.54,0)
DO_1N4007
  round 1.8 hole 1: 1(-4.35,0) 2(4.35,0)
HDR-TH_2P-P2.54-V-M
  rect 2x2 hole 1.2: 1(-1.27,0)
  round 2 hole 1.2: 2(1.27,0)
HDR-TH_3P-P2.54-V-M
  rect 1.7x1.7 hole 1.1: 1(-2.54,0)
  round 1.7 hole 1.1: 2(0,0) 3(2.54,0)
HDR-TH_4P-P2.54-V-M
  rect 1.7x1.7 hole 1.1: 1(-3.81,0)
  round 1.7 hole 1.1: 2(-1.27,0) 3(1.27,0) 4(3.81,0)
M2螺丝
  round 2 hole 2: 1(0,0)
R0805
  rect 1.133x1.377 smd: 1(-1,0) 2(1,0)
R_3296
  round 1.524 hole 0.762: 1(-2.499,-0.127) 2(0,-0.127) 3(2.499,-0.127)
SMA-TH_BWSMA-KE-Z001
  round 2.2 hole 1.5: 1(-2.55,-2.55) 2(-2.55,2.55) 3(2.55,2.55) 4(2.55,-2.55)
  round 2 hole 1.35: 5(0,0)
SOIC-8_L4.9-W3.9-P1.27-LS6.0-BL
  oval 0.588x2.045 smd: 1(-1.905,-2.772) 2(-0.635,-2.772) 3(0.635,-2.772) 4(1.905,-2.772) 5(1.905,2.772) 6(0.635,2.772) 7(-0.635,2.772) 8(-1.905,2.772)
TO-220-5_L10.2-W4.8-P1.70-TL
  rect 2x2 hole 1.3: 1(-2.025,3.4)
  round 2 hole 1.3: 2(2.025,1.7) 3(-2.025,0) 4(2.025,-1.7) 5(-2.025,-3.4)

## Nets
+9V: +.1 +.2 +.3 C1a.2 C1c.2 C12a1.1 C12a2.1 C12a4.1 C12a5.1 C14.2 C17.2 U5.8 U6.8 U7.8 U8.8 功放.4 功放#2.4
-9V: -.1 -.2 -.3 C1#2.2 C12a.1 C12a3.1 C12a6.1 C12a7.1 C12c.2 C13.2 C13b.2 U5.4 U6.4 U7.4 U8.4
GND: C1.1 C1a.1 C1c.1 C3.1 C12a.2 C12a1.2 C12a2.2 C12a3.2 C12a4.2 C12a5.2 C12a6.2 C12a7.2 C12c.1 C13.1 C13b.1 C14.1 C17.1 C18.1 C19.2 C20.1 C22.2 C23.2 C25.1 C26.2 C27.1 C29.2 C30.2 D3.2 GND.1 GND.2 GND.3 OUT      GND.2 OUT      GND#2.2 PR1.1 PR2.1 R4.1 R5.1 R10.1 R16.1 RF5.1 RF5.2 RF5.3 RF5.4 RF6.1 RF6.2 RF6.3 RF6.4 U9.3 U10.3 低通 IN.2 低通 IN#2.1 低通 IN#2.2 低通 IN#2.3 低通 IN#2.4 低通 OUT.2 低通 OUT#2.1 低通 OUT#2.2 低通 OUT#2.3 低通 OUT#2.4 功放.1 功放.2 功放#2.1 功放#2.2 高通 IN.1 高通 IN#2.1 高通 IN#2.2 高通 IN#2.3 高通 IN#2.4 高通 OUT.2 高通 OUT#2.1 高通 OUT#2.2 高通 OUT#2.3 高通 OUT#2.4
VCC: C19.1 C20.2 C26.1 C27.2 D2.1 D4.1 R9.2 R15.2 U9.5 U10.5
INT1: R1.1 低通 IN.1 低通 IN#2.5
OUT1: PR1.3 U6.1 U6.2 低通 OUT.1 低通 OUT#2.5 功放.3
OUT2: PR2.3 U8.1 U8.2 功放#2.3 高通 OUT.1 高通 OUT#2.5
$1N3107: C04.2 高通 IN.2 高通 IN#2.5
$1N5475: C3.2 R2.2 U6.3
$1N5778: C04.1 C05.1 R8.1
$1N5998: C2.1 R1.2 R7.1
$1N9501: C1.2 R7.2 U5.3
$1N9967: C05.2 R4.2 U7.3
$1N9995: C06.2 R8.2 U7.1 U7.2
$1N10092: C06.1 R5.2 U8.3
$1N24062: C2.2 R2.1 U5.1 U5.2
$1N24552: C21.2 PR1.2
$1N24662: C18.2 R9.1 R10.2 R11.1
$1N24719: C22.1 R12.1
$1N29433: C21.1 R11.2 U9.1
$1N29453: D1.2
$1N29500: C23.1 R13.1
$1N29639: R12.2 R14.1 U9.2
$1N29806: C24.1 D1.1 D2.2 R13.2 R14.2 U9.4
$1N30495: C28.2 PR2.2
$1N30496: C25.2 R15.1 R16.2 R17.1
$1N30497: C29.1 R18.1
$1N30500: C28.1 R17.2 U10.1
$1N30515: C30.1 R19.1
$1N30517: R18.2 R20.1 U10.2
$1N30526: C31.1 D3.1 D4.2 R19.2 R20.2 U10.4
$1N30613: C24.2 OUT      GND#2.1 RF5.5
$1N30689: C31.2 OUT      GND.1 RF6.5

Pads without a net: C1#2 1; TP1 1; TP2 1; TP3 1; TP4 1; TP5 1; TP6 1; U5 5 6 7; U6 5 6 7; U7 5 6 7; U8 5 6 7

## Via types
v1: diameter 0.762, hole 0.3, Top Layer to Bottom Layer, 33 vias

## Routing (per net, layer and track width the routed paths; a pad name or vN(x,y) marks a point on that pad's centre or on a via; arc(x,y) is an arc through that point)
+9V: length 164.5
  Top Layer w1.016: 20.46,40.66 20.53,40.59 20.53,34.57 ; U5.8 20.41,40.54 ; 45.43,34.62 45.37,34.57 20.53,34.57 ; 45.43,34.62 45.43,32.03 45.48,31.97 45.48,29.23 ; 45.43,34.62 45.59,53.26 U6.8 ; 20.53,34.57 17.15,34.57 11.94,29.36 +.3 +.2 +.1 ; 20.53,34.57 20.53,32.03 20.59,31.97 20.59,26.32 20.57,26.31 ; 20.57,27.07 20.57,26.31 ; 20.57,26.31 U7.8 ; 功放#2.4 62.74,20.47 61.21,21.99 47.37,21.99 45.59,20.22 U8.8 45.43,18.08 45.48,29.23 ; 45.48,28.34 45.48,29.23
  Bottom Layer w1.016: 功放.4 62.99,56.79 60.83,58.95 54.1,58.95 52.32,57.17 52.32,55.39 50.42,53.49 45.55,53.49 v1(45.42,53.62)
-9V: length 192.9
  Top Layer w1.016: U6.4 50.78,57.43 C13b.2 50.71,60.67 50.71,65.05 ; v1(24.38,12.47) 24.38,9.18 C1.2 24.37,5.03 v1(24.42,4.98) ; v1(49.4,13.83) U8.4 49.4,8.77 ; 49.44,4.98 49.44,8.73 49.4,8.77 ; 49.4,8.77 49.39,8.79 ; v1(25.95,65.05) 25.95,60.66 C13.2 25.89,57.44 v1(25.91,57.43)
  Bottom Layer w1.016: 33.84,65.05 35.56,63.32 35.56,63.11 37.5,65.05 36.58,65.05 36.2,64.67 ; 34.23,4.98 arc(34.78,5.84) 35.43,6.63 ; 37.08,4.98 arc(36.35,5.77) 35.69,6.63 ; 35.56,4.98 v1(24.42,4.98) ; 35.56,4.98 v1(49.53,4.98) ; 35.56,4.98 35.56,40.54 ; 35.56,40.54 -.3 -.2 -.1 ; 35.56,40.54 35.56,65.03 35.58,65.05 ; 50.93,64.79 50.67,65.05 35.58,65.05 ; 35.58,65.05 v1(25.95,65.05) ; v1(24.38,13.83) v1(24.38,12.47) ; 33.8,40.65 35.43,38.79 35.43,42.22 33.8,40.65
  vias: v1(50.75,65.05) v1(50.93,57.43)
VCC: length 129.6
  Top Layer w1.016: U10.5 76.1,7.12 v1(72.26,7.12) 72.26,11.56 C27.2 ; C20.2 71.88,58.46 C19.1 ; C19.1 71.88,63.14 64.14,63.14 62.99,62 62.99,56.03 ; C19.1 72.5,63.14 72.64,63.14 74.04,61.74 82.93,61.74 85.21,59.47 U9.5 ; v1(81.15,14.5) 81.15,22.74 v1(79.49,24.41) 79.49,25.79 D4.1 D2.1
  Bottom Layer w1.016: U10.5 81.15,12.18 v1(81.15,14.5) ; 62.74,14.37 61.09,12.72 61.09,5.61 61.72,4.98 70.61,4.98 72.26,6.63 72.26,7.26 ; U9.5 85.57,44.44 83.06,41.93 76.68,41.93
  vias: v1(85.4,48.92)
INT1: length 15.6
  Top Layer w0.508: R1.1 低通 IN#2.5 低通 IN.1
OUT1: length 50.4
  Top Layer w0.508: v1(71.88,64.54) 59.82,64.54 56.64,61.36 56.64,53.87 56.9,53.62 ; 56.9,53.62 U6.1 U6.2 ; 56.9,53.62 62.86,53.62 功放.3
  Bottom Layer w0.508: v1(71.88,64.54) 71.88,52.43 PR1.3
OUT2: length 67.1
  Top Layer w0.508: 57.4,16.02 59.94,16.02 61.21,14.75 61.21,13.36 功放#2.3 ; 57.4,16.02 46.48,16.02 45.59,15.14 U8.1 U8.2 ; 57.4,16.02 56.69,15.31 56.69,8.11 57.4,7.39 ; PR2.3 70.06,22.84 68.58,21.36 68.58,5.86 67.69,4.98 57.79,4.98 56.9,5.86 56.9,7.39
$1N3107: length 16.2
  Top Layer w0.508: C04.2 高通 IN#2.5 高通 IN.2
  Bottom Layer w0.254: 7.49,8.06 arc(7.42,7.88) 7.23,7.8
$1N5475: length 16.1
  Top Layer w0.508: R2.2 C3.2
  Bottom Layer w0.508: v1(41.66,56.16) v1(50.78,56.16)
$1N5778: length 18.9
  Top Layer w0.508: R8.1 C04.1 17.38,14.99 15.38,12.99 C05.1
$1N5998: length 24.1
  Top Layer w0.508: R1.2 17,56.55 15,58.55 R7.1
  Bottom Layer w0.508: v1(14.95,60.62) 31.24,60.62 v1(31.26,60.6)
$1N9501: length 16.1
  Top Layer w0.508: C1.2 U5.3 24.26,56.03 19.69,60.6 R7.2
$1N9967: length 16.1
  Top Layer w0.508: C05.2 v1(21.97,11.45) 22.73,11.45 23.11,11.83 U7.3
  Bottom Layer w0.508: v1(30.86,11.45) v1(21.97,11.45)
$1N9995: length 21.5
  Top Layer w0.508: U7.1 21.84,13.13 21.84,14.5 22.35,15.01 32,15.01 32.75,15.75 R8.2 C06.2
$1N10092: length 12.7
  Top Layer w0.508: U8.3 48.13,11.2 47.75,10.82 42.4,10.82 R5.2 C06.1
$1N24062: length 26.5
  Top Layer w0.508: C2.2 R2.1 39.62,60.59 39.62,56.66 36.45,53.49 U5.1 U5.2
$1N24552: length 5.8
  Bottom Layer w0.508: v1(76.98,51.97) 75.06,51.97 72.77,49.68 PR1.2
$1N24662: length 19.6
  Top Layer w0.508: C18.2 75.69,54.89 75.18,54.38 75.18,49.55 75.82,48.92 R11.1 76.72,48.65 ; R9.1 81.41,48.92 79.88,47.39 77.98,47.39 76.72,48.65 ; 76.72,48.65 R10.2
$1N24719: length 9.9
  Top Layer w0.508: R12.1 84.45,46.62 v1(84.45,46.76)
  Bottom Layer w0.508: v1(83.45,54.89) 84.45,53.89 v1(84.45,46.76)
$1N29433: length 11.4
  Top Layer w0.508: v1(78.98,51.97) 78.98,49.17 R11.2
  Bottom Layer w0.508: U9.1 78.77,57.58 77.98,56.79 77.98,54.25 78.98,53.25 v1(78.98,51.97)
$1N29500: length 3.1
  Top Layer w1.016: R13.1 C23.1
$1N29639: length 19.8
  Top Layer w0.508: v1(83.33,51.84) 84.33,50.84 84.33,47.9 83.33,46.9 R12.2
  Bottom Layer w0.508: U9.2 80.47,58.75 82.04,57.17 82.04,53.12 v1(83.33,51.84)
$1N29806: length 50.3
  Top Layer w0.508: 85.38,41.93 85.6,41.93 87.38,43.71 87.38,51.2 86.74,51.84 86.61,51.84 ; 86.61,51.84 R14.2 ; 86.61,51.84 87.5,52.73 87.5,54.38 88.38,55.25 R13.2 89.28,55.65 90.17,56.54 96.52,56.54 97.31,57.33 D1.1 97.31,62.51 95.41,64.41 91.82,64.41 91.19,65.05 91.19,65.94 ; C24.1 91.19,65.94 ; 91.19,65.94 84.63,65.94 83.87,65.17 U9.4
$1N30495: length 6.2
  Top Layer w0.508: PR2.2 74.04,20.34 75.69,18.69 C28.2
$1N30496: length 13.7
  Top Layer w0.508: R15.1 v1(77.49,21.49)
  Bottom Layer w0.508: v1(77.49,21.49) v1(77.49,15.9) v1(82.69,15.9)
$1N30497: length 3
  Top Layer w0.508: R18.1 84.69,21.49 C29.1
$1N30500: length 14.2
  Top Layer w0.508: C28.1 79.74,16.15 R17.2 79.49,13.75 80.26,12.98 84.84,12.98 85.57,12.24 U10.1
$1N30515: length 2.4
  Top Layer w0.508: C30.1 R19.1
$1N30517: length 19.4
  Top Layer w0.508: R20.1 R18.2 v1(82.55,21.61)
  Bottom Layer w0.508: v1(82.55,21.61) 83.69,20.47 83.69,5.92 U10.2
$1N30526: length 41.3
  Top Layer w0.508: C31.1 91.57,4.09 88.87,6.79 D3.1 ; D3.1 87.76,9.71 87.76,8.53 86.87,7.64 82.37,7.64 U10.4 ; D3.1 89.28,11.23 R19.2 89.01,14.77 86.87,16.91 86.87,22.23 R20.2 85.38,25.34 D4.2
$1N30613: length 26.5
  Top Layer w0.508: RF5.5 95.5,45.11 96.52,44.09 96.52,39.77 OUT      GND#2.1
  Bottom Layer w0.508: RF5.5 95.5,54.76 91.19,59.07 v1(91.19,61.24)
$1N30689: length 21.6
  Top Layer w0.508: 91.57,6.99 91.69,7.12 91.69,9.8 95.38,13.48 RF6.5 95.38,25.8 OUT      GND.1

## Copper pours and planes (outline as drawn; the poured copper is in the pictures)
GND on Top Layer: -0.13,69.36 99.95,69.36 99.95,-0.1 -0.13,-0.1
GND on Bottom Layer: -0.58,69.38 99.5,69.38 99.5,-0.09 -0.58,-0.09

Small or netless copper shapes (teardrops, artwork), in the pictures only: 1 on Bottom Layer

## Text on the board
Top Silkscreen Layer: 测试点 A | 测试点 B

# Board 滤波器
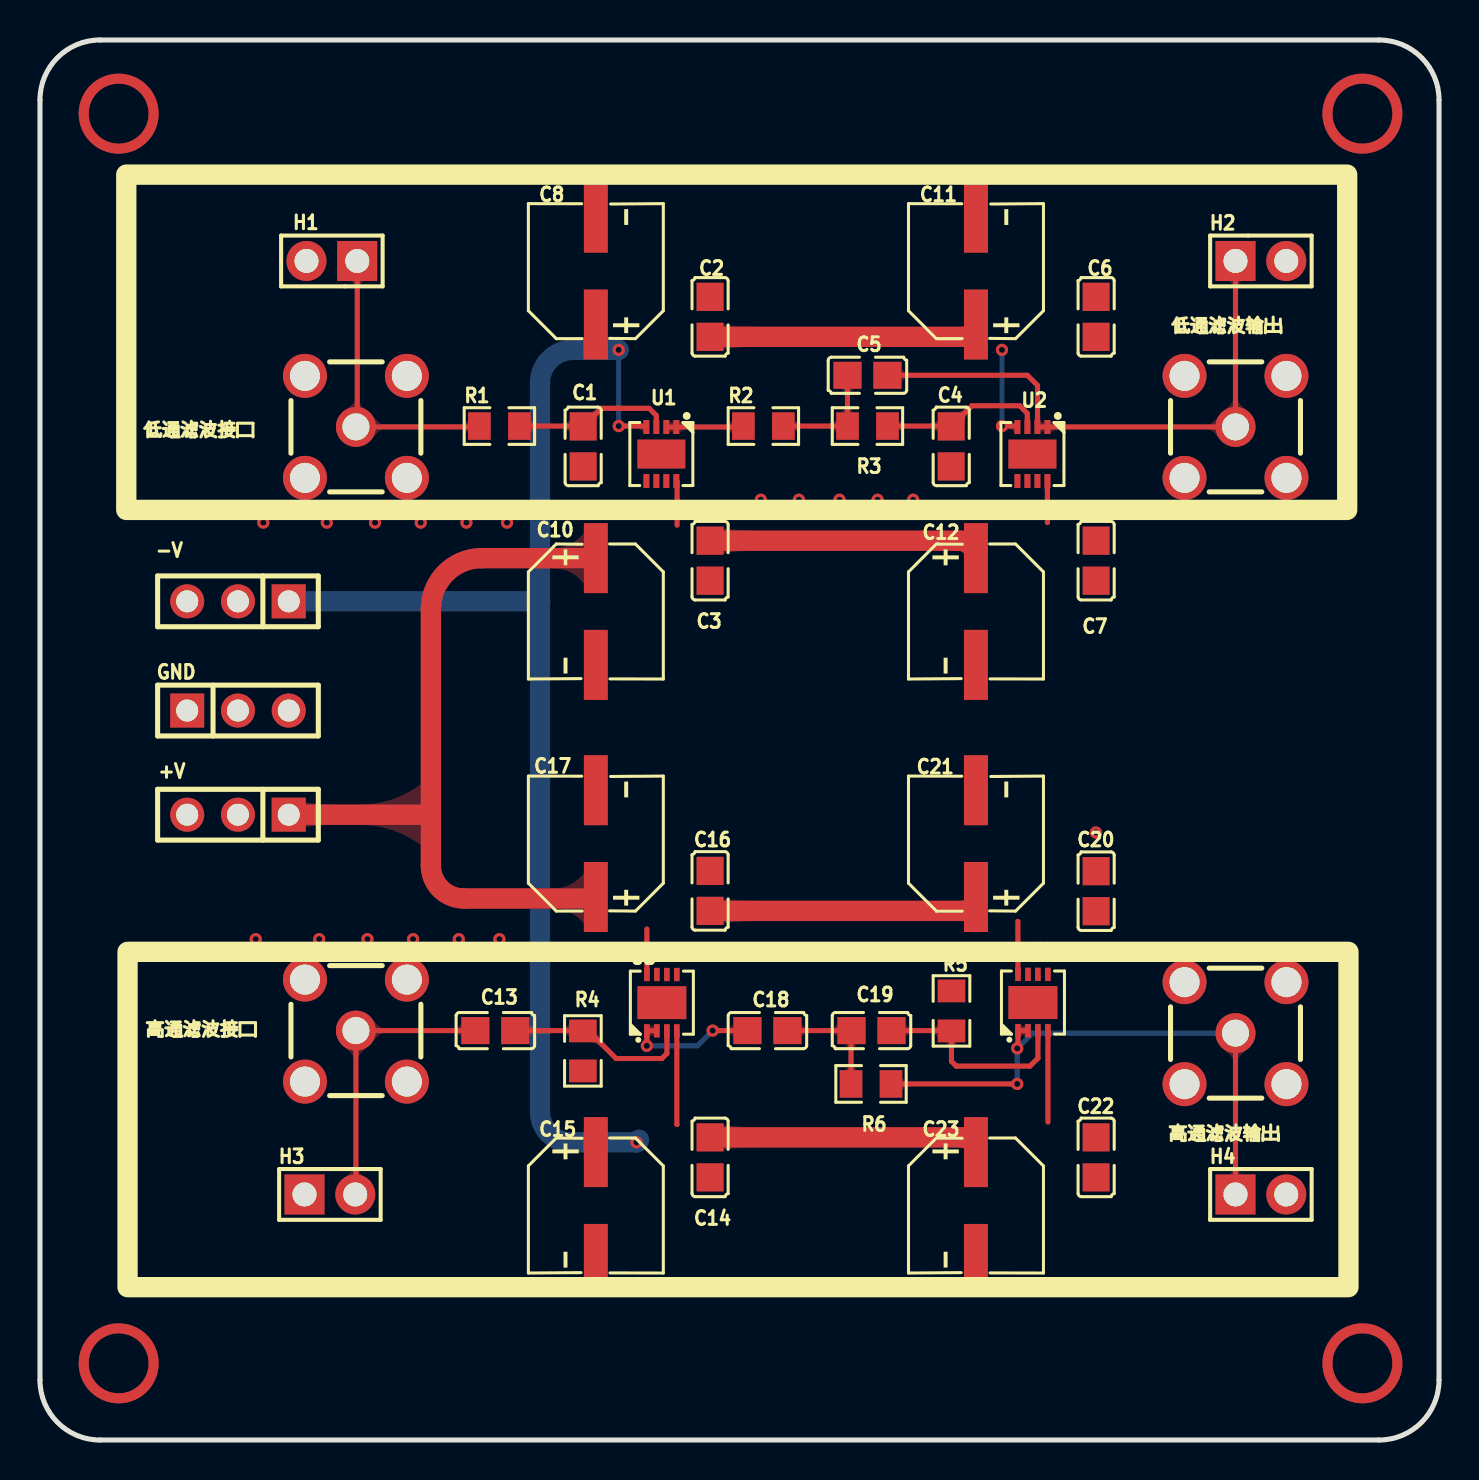
[diagram p4: board, top side]
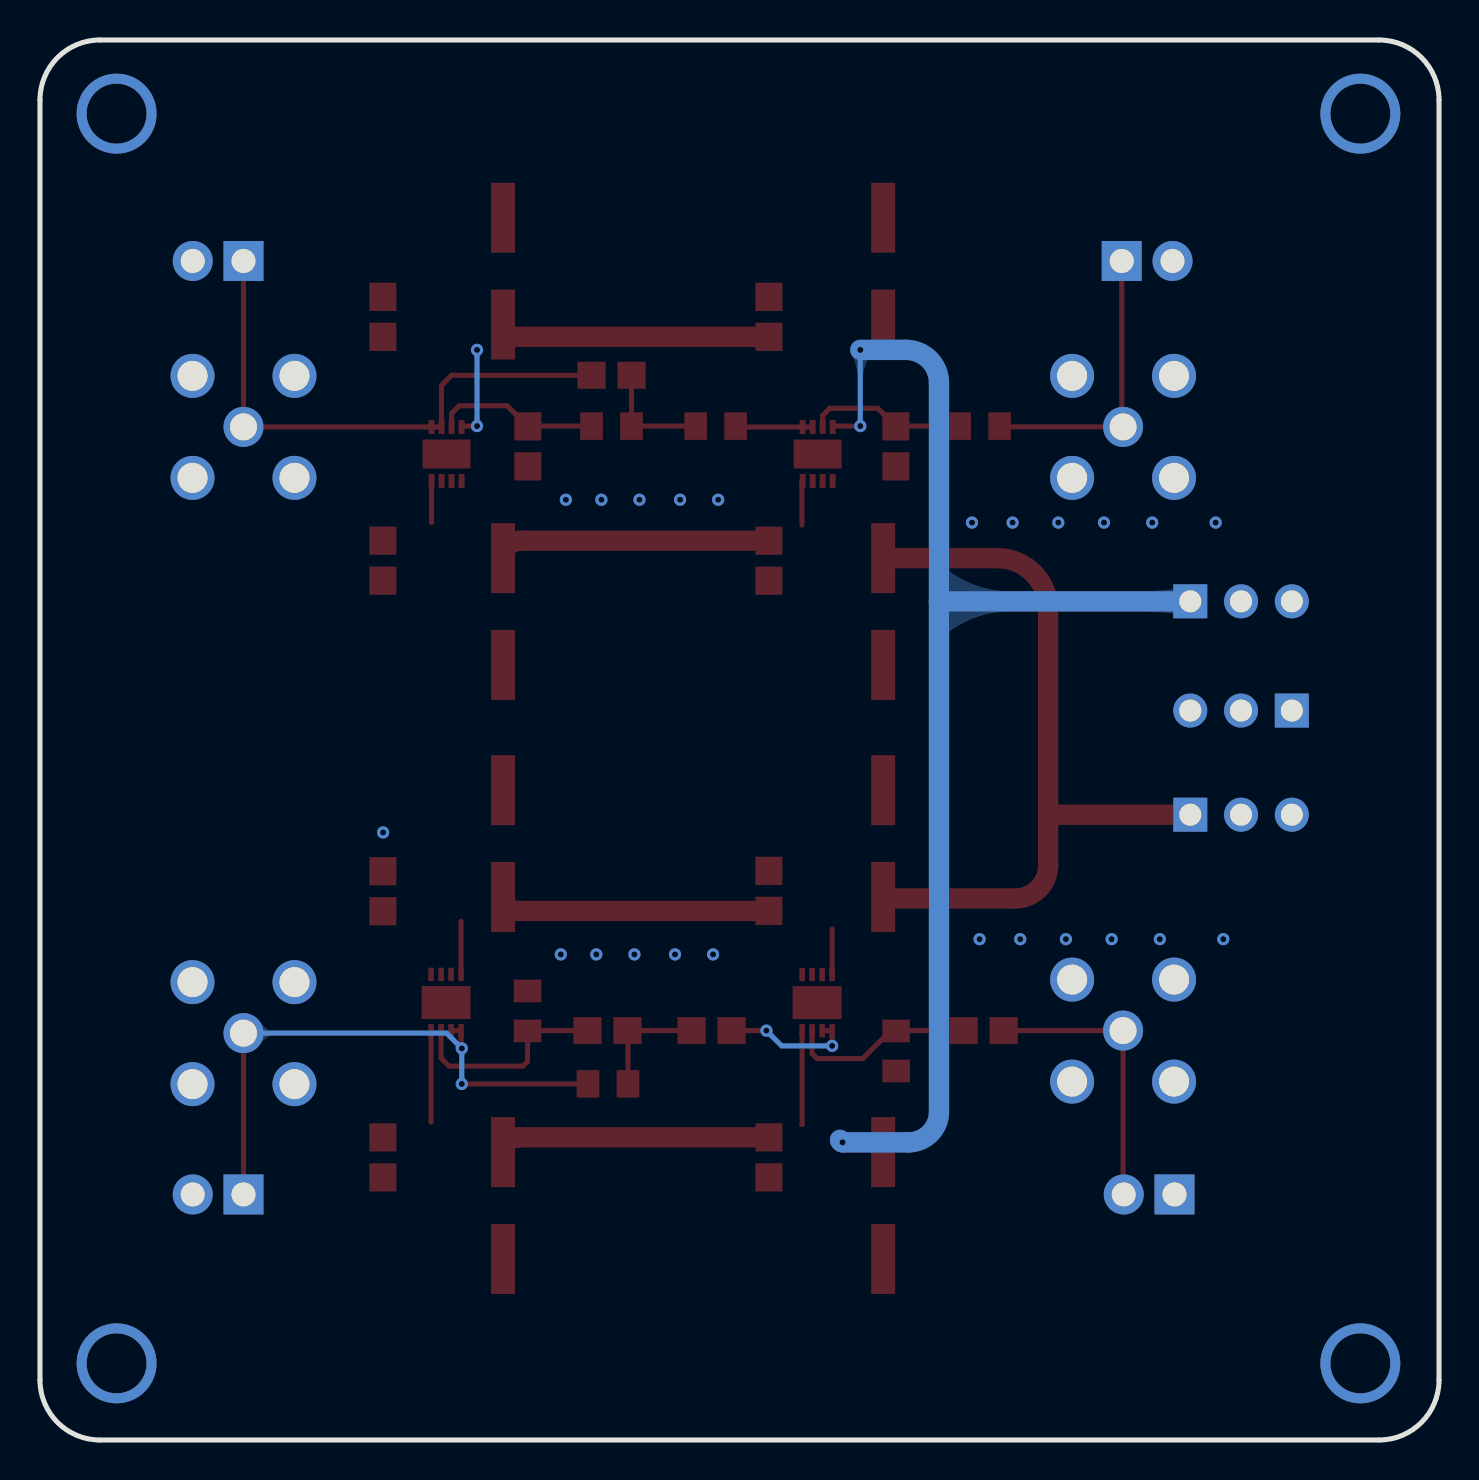
[diagram p5: board, bottom side, seen from below]

Outline 70 x 70 mm; copper layers: Top Layer, Bottom Layer. Coordinates in mm from the lower left corner of the outline.
Outline path: 0,67 0,3 arc(0.88,0.88) 3,0 67,0 arc(69.12,0.88) 70,3 70,67 arc(69.12,69.12) 67,70 3,70 arc(0.88,69.12) 0,67
Stack: Top Layer 0.035mm / Dielectric1 1.51mm FR4 er 4.5 / Bottom Layer 0.035mm

## Design rules (mm)
template: 自定义配置
spacing copperThickness1oz (default): track to track 0.102, other pairs 0.152 to 0.3
spacing copperThickness2oz: track to track 0.203, other pairs 0.152 to 0.3
track width copperThickness1oz (default): min 0.127, default 0.254, max 2.54
track width copperThickness2oz: min 0.203, default 0.254, max 2.54
differential pair differentialPair (default): width min 0.127, default 0.254, max 2.54; gap min 0.152, default 0.152
via viaSize (default): diameter min 0.5, default 0.61, max 10; hole min 0.3, default 0.305, max 6.3

## Placement (name value [footprint] x y rotation side)
+V  PZ254V-11-03P  [HDR-TH_3P-P2.54-V-M]  9.91 31.27 180 top
-V  PZ254V-11-03P  [HDR-TH_3P-P2.54-V-M]  9.91 41.93 180 top
C1  1nF  [C0805]  27.18 49.68 90 top
C2  100nF  [C0805]  33.53 56.16 270 top
C3  100nF  [C0805]  33.53 43.97 90 top
C4  200pF  [C0805]  45.59 49.68 90 top
C5  1nF  [C0805]  41.4 53.24 180 top
C6  100nF  [C0805]  52.84 56.16 270 top
C7  100nF  [C0805]  52.84 43.97 90 top
C8  10uF  [CAP-SMD_BD6.3-L6.6-W6.6-FD]  27.81 58.44 90 top
C10  10uF  [CAP-SMD_BD6.3-L6.6-W6.6-FD]  27.81 41.42 270 top
C11  10uF  [CAP-SMD_BD6.3-L6.6-W6.6-FD]  46.83 58.44 90 top
C12  10uF  [CAP-SMD_BD6.3-L6.6-W6.6-FD]  46.83 41.42 270 top
C13  100nF  [C0805]  22.78 20.47 180 top
C14  100nF  [C0805]  33.53 14.13 90 top
C15  10uF  [CAP-SMD_BD6.3-L6.6-W6.6-FD]  27.81 11.72 270 top
C16  100nF  [C0805]  33.53 27.45 270 top
C17  10uF  [CAP-SMD_BD6.3-L6.6-W6.6-FD]  27.81 29.82 90 top
C18  100nF  [C0805]  36.4 20.47 180 top
C19  100nF  [C0805]  41.6 20.47 180 top
C20  100nF  [C0805]  52.84 27.44 270 top
C21  10uF  [CAP-SMD_BD6.3-L6.6-W6.6-FD]  46.83 29.82 90 top
C22  100nF  [C0805]  52.84 14.13 90 top
C23  10uF  [CAP-SMD_BD6.3-L6.6-W6.6-FD]  46.83 11.72 270 top
GND  PZ254V-11-03P  [HDR-TH_3P-P2.54-V-M]  9.91 36.47 0 top
H1  PZ254V-11-02P  [HDR-TH_2P-P2.54-V-M]  14.61 58.95 180 top
H2  PZ254V-11-02P  [HDR-TH_2P-P2.54-V-M]  61.09 58.95 0 top
H3  PZ254V-11-02P  [HDR-TH_2P-P2.54-V-M]  14.51 12.28 0 top
H4  PZ254V-11-02P  [HDR-TH_2P-P2.54-V-M]  61.09 12.28 0 top
R1  78.7kΩ  [R0805]  22.99 50.7 0 top
R2  118kΩ  [R0805]  36.2 50.7 0 top
R3  243kΩ  [R0805]  41.4 50.7 0 top
R4  402kΩ  [R0805]  27.16 19.45 90 top
R5  787kΩ  [R0805]  45.61 21.45 270 top
R6  200kΩ  [R0805]  41.58 17.8 0 top
U1  LT6023IDD#PBF  [DFN-8_L3.0-W3.0-P0.50-BL-EP-1]  31.09 49.3 180 top
U2  LT6023IDD#PBF  [DFN-8_L3.0-W3.0-P0.50-BL-EP-1]  49.66 49.3 180 top
U3  LT6004CDD#PBF  [DFN-8_L3.0-W3.0-P0.50-BL-EP]  31.11 21.87 0 top
U4  LT6004CDD#PBF  [DFN-8_L3.0-W3.0-P0.50-BL-EP]  49.68 21.87 0 top
低通滤波接口  BWSMA-KE-Z001  [SMA-TH_BWSMA-KE-Z001]  15.81 50.66 0 top
低通滤波输出  BWSMA-KE-Z001  [SMA-TH_BWSMA-KE-Z001]  59.82 50.66 0 top
高通滤波接口  BWSMA-KE-Z001  [SMA-TH_BWSMA-KE-Z001]  15.81 20.47 0 top
高通滤波输出  BWSMA-KE-Z001  [SMA-TH_BWSMA-KE-Z001]  59.82 20.34 0 top

## Footprints (pads in the part's own frame, mm; a bottom-side part is the same pattern mirrored in y, then rotated)
C0805
  rect 1.41x1.35 smd: 1(-1,0) 2(1,0)
CAP-SMD_BD6.3-L6.6-W6.6-FD
  rect 3.5x1.2 smd: 1(-2.67,0) 2(2.67,0)
DFN-8_L3.0-W3.0-P0.50-BL-EP
  rect 0.28x0.665 smd: 1(-0.75,-1.407) 2(-0.25,-1.407) 3(0.25,-1.407) 4(0.75,-1.407) 5(0.75,1.407) 6(0.25,1.407) 7(-0.25,1.407) 8(-0.75,1.407)
  rect 2.45x1.65 smd: 9(0,0)
DFN-8_L3.0-W3.0-P0.50-BL-EP-1
  rect 0.3x0.7 smd: 1(-0.75,-1.35) 2(-0.25,-1.35) 3(0.25,-1.35) 4(0.75,-1.35) 5(0.75,1.35) 6(0.25,1.35) 7(-0.25,1.35) 8(-0.75,1.35)
  rect 2.4x1.45 smd: 9(0,0)
HDR-TH_2P-P2.54-V-M
  rect 2x2 hole 1.2: 1(-1.27,0)
  round 2 hole 1.2: 2(1.27,0)
HDR-TH_3P-P2.54-V-M
  rect 1.7x1.7 hole 1.1: 1(-2.54,0)
  round 1.7 hole 1.1: 2(0,0) 3(2.54,0)
R0805
  rect 1.133x1.377 smd: 1(-1,0) 2(1,0)
SMA-TH_BWSMA-KE-Z001
  round 2.2 hole 1.5: 1(-2.55,-2.55) 2(-2.55,2.55) 3(2.55,2.55) 4(2.55,-2.55)
  round 2 hole 1.35: 5(0,0)

## Nets
+9V: +V.1 +V.2 +V.3 C3.2 C7.2 C10.1 C12.1 C16.2 C17.1 C20.2 C21.1 U1.8 U2.8 U3.8 U4.8
-9V: -V.1 -V.2 -V.3 C2.2 C6.2 C8.1 C11.1 C14.2 C15.1 C22.2 C23.1 U1.4 U2.4 U3.4 U4.4
GND: C1.1 C2.1 C3.1 C4.1 C6.1 C7.1 C8.2 C10.2 C11.2 C12.2 C14.1 C15.2 C16.1 C17.2 C20.1 C21.2 C22.1 C23.2 GND.1 GND.2 GND.3 H1.2 H2.2 H3.1 H4.2 R4.1 R5.1 低通滤波接口.1 低通滤波接口.2 低通滤波接口.3 低通滤波接口.4 低通滤波输出.1 低通滤波输出.2 低通滤波输出.3 低通滤波输出.4 高通滤波接口.1 高通滤波接口.2 高通滤波接口.3 高通滤波接口.4 高通滤波输出.1 高通滤波输出.2 高通滤波输出.3 高通滤波输出.4
INT1: H1.1 R1.1 低通滤波接口.5
OUT1: C5.1 H2.1 U2.1 U2.2 低通滤波输出.5
$1N252: C1.2 R1.2 U1.3
$1N745: R2.1 U1.1 U1.2
$1N884: C4.2 R3.2 U2.3
$1N953: C5.2 R2.2 R3.1
$1N2206: C13.1 R4.2 U3.3
$1N2548: C18.2 U3.1 U3.2
$1N2589: C19.1 R5.2 U4.3
$1N3107: C13.2 H3.2 高通滤波接口.5
$1N3641: H4.1 R6.2 U4.1 U4.2 高通滤波输出.5
$1N3642: C18.1 C19.2 R6.1

Pads without a net: U1 5 6 7 9; U2 5 6 7 9; U3 5 6 7 9; U4 5 6 7 9

## Via types
v1: diameter 4, hole 3, Top Layer to Bottom Layer, 4 vias
v2: diameter 0.61, hole 0.305, Top Layer to Bottom Layer, 32 vias

## Routing (per net, layer and track width the routed paths; a pad name or vN(x,y) marks a point on that pad's centre or on a via; arc(x,y) is an arc through that point)
+9V: length 75.6
  Top Layer w0.254: U2.8 50.41,45.87 ; 31.88,45.74 31.88,47.91 arc(31.87,47.94) U1.8 ; U4.8 48.93,25.93 ; U3.8 30.36,25.55
  Top Layer w1.016: C3.2 45.96,44.97 arc(46.58,44.71) C12.1 ; +V.1 19.56,31.27 ; 19.56,31.27 19.56,41.55 arc(20.3,43.35) 22.1,44.09 27.81,44.09 arc(27.81,44.09) C10.1 ; 19.56,31.27 19.56,28.72 arc(20.04,27.56) 21.21,27.07 27.74,27.07 arc(27.79,27.1) C17.1 ; C16.2 46.14,26.45 arc(46.63,26.66) C21.1
-9V: length 106.3
  Top Layer w0.254: v2(28.96,50.7) 30.29,50.7 arc(30.33,50.68) U1.4 ; v2(48.13,50.7) 48.86,50.7 arc(48.89,50.68) U2.4 ; U3.4 31.86,15.78 arc(31.87,15.77) 31.88,15.77 ; U4.4 50.43,15.9
  Top Layer w1.016: C14.2 46.09,15.13 arc(46.61,14.92) 46.83,14.39 ; C2.2 46.21,55.16 arc(46.65,55.34) C11.1
  Bottom Layer w0.254: v2(28.96,50.7) v2(28.96,54.51) ; v2(48.13,50.7) v2(48.13,54.51)
  Bottom Layer w1.016: v2(28.96,54.51) 26.67,54.51 arc(25.5,54.02) 25.02,52.86 25.02,41.93 ; -V.1 25.02,41.93 ; 25.02,41.93 25.02,16.41 arc(25.47,15.33) 26.54,14.88 v2(29.84,14.88) arc(29.93,14.92) 29.97,15.01
GND:
  vias: v2(10.8,25.04) v2(11.18,45.87) v2(13.97,25.04) v2(14.35,45.87) v2(16.38,25.04) v2(16.76,45.87) v2(18.67,25.04) v2(19.05,45.87) v2(20.95,25.04) v2(21.34,45.87) v2(22.99,25.04) v2(23.37,45.87) v2(36.07,47.01) v2(36.32,24.28) v2(37.97,47.01) v2(38.23,24.28) v2(40.01,47.01) v2(40.26,24.28) v2(41.91,47.01) v2(42.16,24.28) v2(43.69,47.01) v2(43.94,24.28) v2(52.83,30.38)
(no net):
  vias: v1(3.94,66.32) v1(3.94,3.83) v1(66.17,66.32) v1(66.17,3.83)
INT1: length 14.5
  Top Layer w0.254: H1.1 15.87,50.72 低通滤波接口.5 21.95,50.66 R1.1
OUT1: length 28
  Top Layer w0.254: 59.82,50.66 H2.1 ; 49.91,50.65 59.81,50.65 低通滤波输出.5 ; 49.91,50.65 49.91,52.73 49.4,53.24 C5.1 ; 49.91,50.65 U2.2
$1N252: length 8
  Top Layer w0.254: U1.3 30.84,51.22 30.48,51.58 28.08,51.58 C1.2 27.16,50.7 R1.2
$1N745: length 3.9
  Top Layer w0.254: R2.1 35.15,50.65 U1.1 U1.2
$1N884: length 8.3
  Top Layer w0.254: R3.2 45.58,50.7 C4.2 46.62,51.71 49.02,51.71 49.4,51.33 49.4,50.65 U2.3
$1N953: length 6
  Top Layer w0.254: R2.2 R3.1 40.4,53.49
$1N2206: length 9.4
  Top Layer w0.254: C13.1 27.43,20.47 28.83,19.07 31.11,19.07 31.37,19.33 31.37,20.46 U3.3
$1N2548: length 6.6
  Top Layer w0.254: v2(33.65,20.47) C18.2 ; v2(30.36,19.71) U3.1 U3.2
  Bottom Layer w0.254: v2(30.36,19.71) 32.89,19.71 v2(33.65,20.47)
$1N2589: length 10.5
  Top Layer w0.254: C19.1 45.59,20.47 R5.2 45.61,18.93 45.85,18.69 49.53,18.69 49.93,19.09 U4.3
$1N3107: length 14.2
  Top Layer w0.254: H3.2 15.81,12.31 高通滤波接口.5 21.78,20.47
$1N3641: length 28.8
  Top Layer w0.254: R6.2 v2(48.89,17.8) ; U4.2 U4.1 48.93,19.62 v2(48.89,19.58) ; H4.1 高通滤波输出.5
  Bottom Layer w0.254: v2(48.89,17.8) v2(48.89,19.58) 49.66,20.34 高通滤波输出.5
$1N3642: length 5.9
  Top Layer w0.254: R6.1 40.58,20.45 C19.2 C18.1

## Copper pours and planes (outline as drawn; the poured copper is in the pictures)
+9V on Top Layer: 26.66,43.26 26.67,43.25 26.67,42.87 26.86,42.42 27.3,42.23 31.37,42.23 31.82,42.42 32.01,42.87 32.01,43.89 32.08,44.07 32.26,44.14 34.67,44.14 34.85,44.21 34.92,44.39 34.92,46.2 34.85,46.38 34.67,46.46 26.91,46.46 26.73,46.38 26.66,46.2
+9V on Top Layer: 45.86,28.28 45.87,28.3 45.87,28.68 46.06,29.13 46.51,29.31 50.57,29.31 51.02,29.13 51.21,28.68 51.21,27.66 51.28,27.48 51.46,27.41 53.87,27.41 54.05,27.33 54.13,27.15 54.13,25.34 54.05,25.16 53.87,25.09 46.11,25.09 45.93,25.16 45.86,25.34
+9V on Top Layer: 26.66,28.28 26.67,28.3 26.67,28.68 26.86,29.13 27.3,29.31 31.37,29.31 31.82,29.13 32.01,28.68 32.01,27.66 32.08,27.48 32.26,27.41 34.67,27.41 34.85,27.33 34.92,27.15 34.92,25.34 34.85,25.16 34.67,25.09 26.91,25.09 26.73,25.16 26.66,25.34
+9V on Top Layer: 5.89,32.53 13.93,32.53 13.93,30 5.89,30
+9V on Top Layer: 45.86,43.26 45.87,43.25 45.87,42.87 46.06,42.42 46.51,42.23 50.57,42.23 51.02,42.42 51.21,42.87 51.21,43.89 51.28,44.07 51.46,44.14 53.87,44.14 54.05,44.21 54.13,44.39 54.13,46.2 54.05,46.38 53.87,46.46 46.11,46.46 45.93,46.38 45.86,46.2
-9V on Top Layer: 5.89,43.2 13.93,43.2 13.93,40.66 5.89,40.66
-9V on Top Layer: 45.86,13.29 45.87,13.28 45.87,12.9 46.06,12.45 46.51,12.26 50.57,12.26 51.02,12.45 51.21,12.9 51.21,13.92 51.28,14.09 51.46,14.17 53.87,14.17 54.05,14.24 54.13,14.42 54.13,16.23 54.05,16.41 53.87,16.49 46.11,16.49 45.93,16.41 45.86,16.23
-9V on Top Layer: 26.66,57.03 26.67,57.05 26.67,57.43 26.86,57.88 27.3,58.06 31.37,58.06 31.82,57.88 32.01,57.43 32.01,56.41 32.08,56.23 32.26,56.16 34.67,56.16 34.85,56.08 34.92,55.9 34.92,54.09 34.85,53.91 34.67,53.84 26.91,53.84 26.73,53.91 26.66,54.09
-9V on Top Layer: 26.66,13.29 26.67,13.28 26.67,12.9 26.86,12.45 27.3,12.26 31.37,12.26 31.82,12.45 32.01,12.9 32.01,13.92 32.08,14.09 32.26,14.17 34.67,14.17 34.85,14.24 34.92,14.42 34.92,16.23 34.85,16.41 34.67,16.49 26.91,16.49 26.73,16.41 26.66,16.23
-9V on Top Layer: 45.86,57.03 45.87,57.05 45.87,57.43 46.06,57.88 46.51,58.06 50.57,58.06 51.02,57.88 51.21,57.43 51.21,56.41 51.28,56.23 51.46,56.16 53.87,56.16 54.05,56.08 54.13,55.9 54.13,54.09 54.05,53.91 53.87,53.84 46.11,53.84 45.93,53.91 45.86,54.09
GND on Top Layer: 1.02,66.83 1.65,68.35 3.17,68.98 67.56,68.98 68.55,68.57 68.96,67.59 68.96,3.07 68.33,1.54 66.8,0.91 3.17,0.91 1.65,1.54 1.02,3.07
GND on Bottom Layer: 1.02,66.83 1.65,68.35 3.17,68.98 67.56,68.98 68.55,68.57 68.96,67.59 68.96,3.07 68.33,1.54 66.8,0.91 3.17,0.91 1.65,1.54 1.02,3.07

Small or netless copper shapes (teardrops, artwork), in the pictures only: 81 on Top Layer, 13 on Bottom Layer
